# EAGLE schematic soundcard v2.1 (EAGLE 9.6.2)

## Sheet 1 of 8
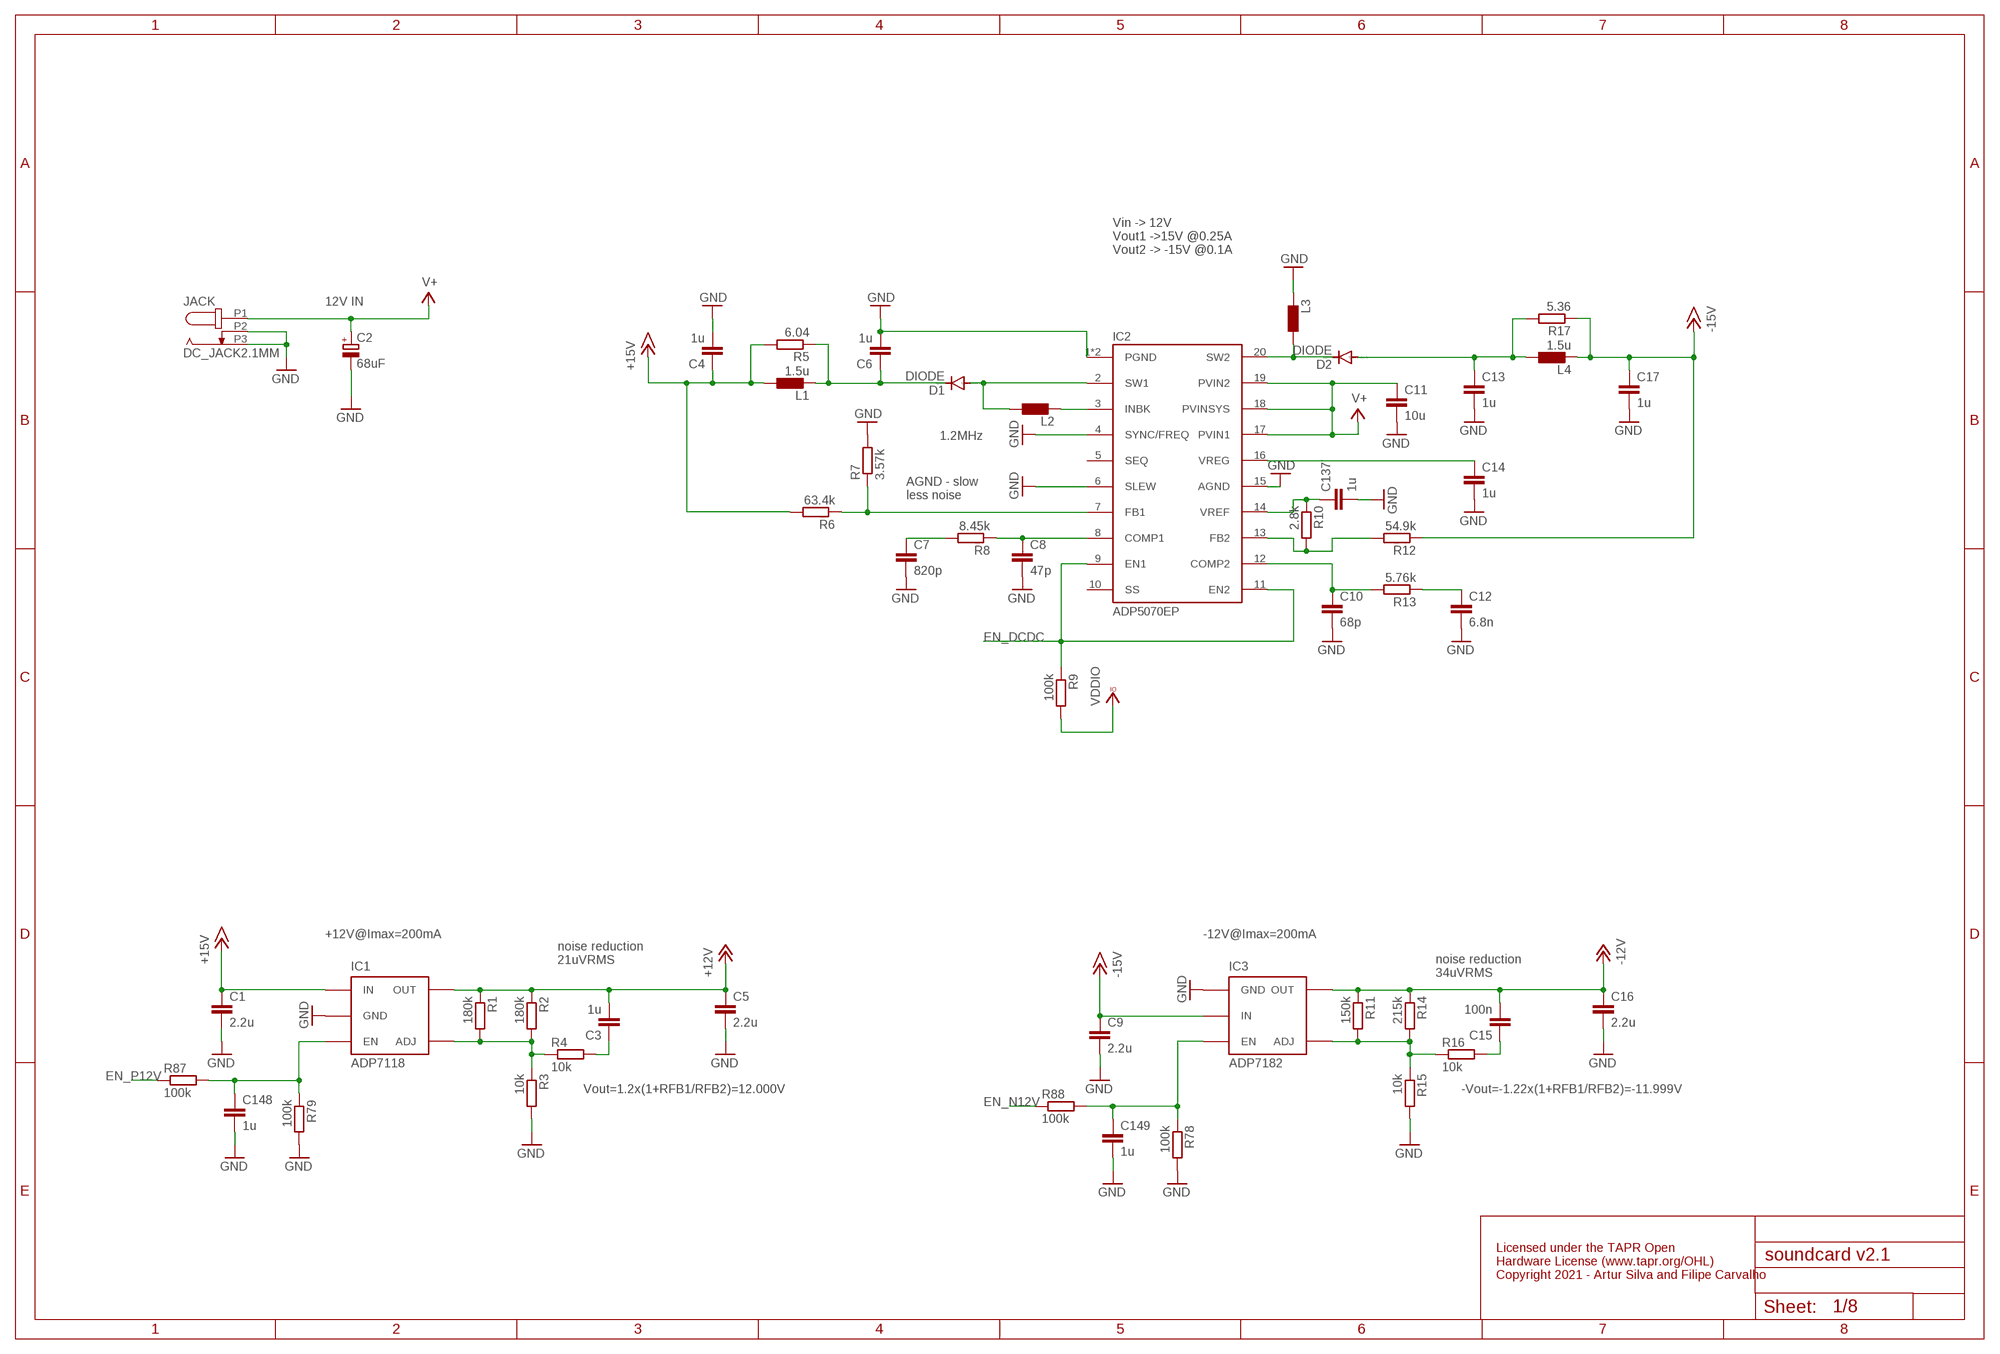
[diagram p0: schematic, sheet 1]

### Parts
C1  2.2u  C-EUC0603  [C0603]
C2  68uF  CPOL-EUE2-5  [E2-5]
C3  1u  C-EUC0402  [C0402]
C4  1u  C-EUC0603  [C0603]
C5  2.2u  C-EUC0603  [C0603]
C6  1u  C-EUC0603  [C0603]
C7  820p  C-EUC0402  [C0402]
C8  47p  C-EUC0402  [C0402]
C9  2.2u  C-EUC0603  [C0603]
C10  68p  C-EUC0402  [C0402]
C11  10u  C-EUC1206  [C1206]
C12  6.8n  C-EUC0402  [C0402]
C13  1u  C-EUC0603  [C0603]
C14  1u  C-EUC0402  [C0402]
C15  100n  C-EUC0402  [C0402]
C16  2.2u  C-EUC0603  [C0603]
C17  1u  C-EUC0603  [C0603]
C137  1u  C-EUC0402  [C0402]
C148  1u  C-EUC0603  [C0603]
C149  1u  C-EUC0603  [C0603]
D1  DIODE  [SOD-323-DIODE]
D2  DIODE  [SOD-323-DIODE]
IC1  ADP7118  [TSOT23-5]
IC2  ADP5070EP  [TSSOP-EP-20]
IC3  ADP7182  [TSOT23-5]
JACK  DC_JACK2.1MM  [DC_POWER_INPUT_2.1MM]
L1  1.5u  INDLPS4012_L  [IND_LPS4012_V2]
L2  INDLPS6225_L  [IND_LPS6225_V2]
L3  INDLPS6225_L  [IND_LPS6225_V2]
L4  1.5u  INDLPS4012_L  [IND_LPS4012_V2]
R1  180k  R-EU_R0402  [R0402]
R2  180k  R-EU_R0402  [R0402]
R3  10k  R-EU_R0402  [R0402]
R4  10k  R-EU_R0402  [R0402]
R5  6.04  R-EU_R0402  [R0402]
R6  63.4k  R-EU_R0402  [R0402]
R7  3.57k  R-EU_R0402  [R0402]
R8  8.45k  R-EU_R0402  [R0402]
R9  100k  R-EU_R0402  [R0402]
R10  2.8k  R-EU_R0402  [R0402]
R11  150k  R-EU_R0402  [R0402]
R12  54.9k  R-EU_R0402  [R0402]
R13  5.76k  R-EU_R0402  [R0402]
R14  215k  R-EU_R0402  [R0402]
R15  10k  R-EU_R0402  [R0402]
R16  10k  R-EU_R0402  [R0402]
R17  5.36  R-EU_R0402  [R0402]
R78  100k  R-EU_R0402  [R0402]
R79  100k  R-EU_R0402  [R0402]
R87  100k  R-EU_R0402  [R0402]
R88  100k  R-EU_R0402  [R0402]

### Nets
+12V: C3.2 C5.1 IC1.5(OUT) R1.1 R2.1 ; also sheet 3,4
+15V: C1.1 C4.1 IC1.1(IN) L1.1 R5.2 R6.2
-12V: C15.2 C16.1 IC3.5(OUT) R11.1 R14.1 ; also sheet 3,4
-15V: C9.1 C17.1 IC3.2(IN) L4.2 R12.1 R17.1
EN_DCDC: IC2.9(EN1) IC2.11(EN2) R9.1 ; also sheet 7
EN_N12V: R88.1 ; also sheet 5
EN_P12V: R87.1 ; also sheet 5
GND: C1.2 C2.- C4.2 C5.2 C6.2 C7.2 C8.2 C9.2 C10.2 C11.2 C12.2 C13.2 C14.2 C16.2 C17.2 C137.2 C148.2 C149.2 IC1.2(GND) IC2.1(PGND) IC2.4(SYNC/FREQ) IC2.6(SLEW) IC2.15(AGND) IC2.EPAD(PGND) IC3.1(GND) JACK.P2 JACK.P3 L3.2 R3.2 R7.2 R15.2 R78.2 R79.2 ; also sheet 2,3,4,5,6,7,8
INBK: IC2.3(INBK) L2.2
N$4: IC2.7(FB1) R6.1 R7.1
N$7: C7.1 R8.2
N$9: C8.1 IC2.8(COMP1) R8.1
N$11: C10.1 IC2.12(COMP2) R13.2
N$12: C12.1 R13.1
N$13: C14.1 IC2.16(VREG)
N$14: C3.1 R4.2
N$18: IC2.13(FB2) R10.2 R12.2
N$22: C137.1 IC2.14(VREF) R10.1
N$26: IC1.4(ADJ) R1.2 R2.2 R3.1 R4.1
N$28: IC3.4(ADJ) R11.2 R14.2 R15.1 R16.1
N$29: C15.1 R16.2
N$79: C148.1 IC1.3(EN) R79.1 R87.2
N$83: C149.1 IC3.3(EN) R78.1 R88.2
OUT_SW1: D1.A IC2.2(SW1) L2.1
OUT_SW2: D2.C IC2.20(SW2) L3.1
OUTN15: C13.1 D2.A L4.1 R17.2
OUTP15: C6.1 D1.C L1.2 R5.1
V+: C2.+ C11.1 IC2.17(PVIN1) IC2.18(PVINSYS) IC2.19(PVIN2) JACK.P1 ; also sheet 2,5
VCCIO: R9.2 ; supply symbol labelled VDDIO ; also sheet 6,7,8
Unconnected: IC2.5(SEQ) IC2.10(SS)

### Notes on the sheet
- Vin -> 12V
  Vout1 ->15V @0.25A
  Vout2 -> -15V @0.1A
- 12V IN
- 1.2MHz
- AGND - slow
  less noise
- +12V@Imax=200mA | -12V@Imax=200mA
- noise reduction 
  21uVRMS
- noise reduction 
  34uVRMS
- Vout=1.2x(1+RFB1/RFB2)=12.000V | -Vout=-1.22x(1+RFB1/RFB2)=-11.999V
- Licensed under the TAPR Open 
  Hardware License (www.tapr.org/OHL)
  Copyright 2021 - Artur Silva and Filipe Carvalho

## Sheet 2 of 8
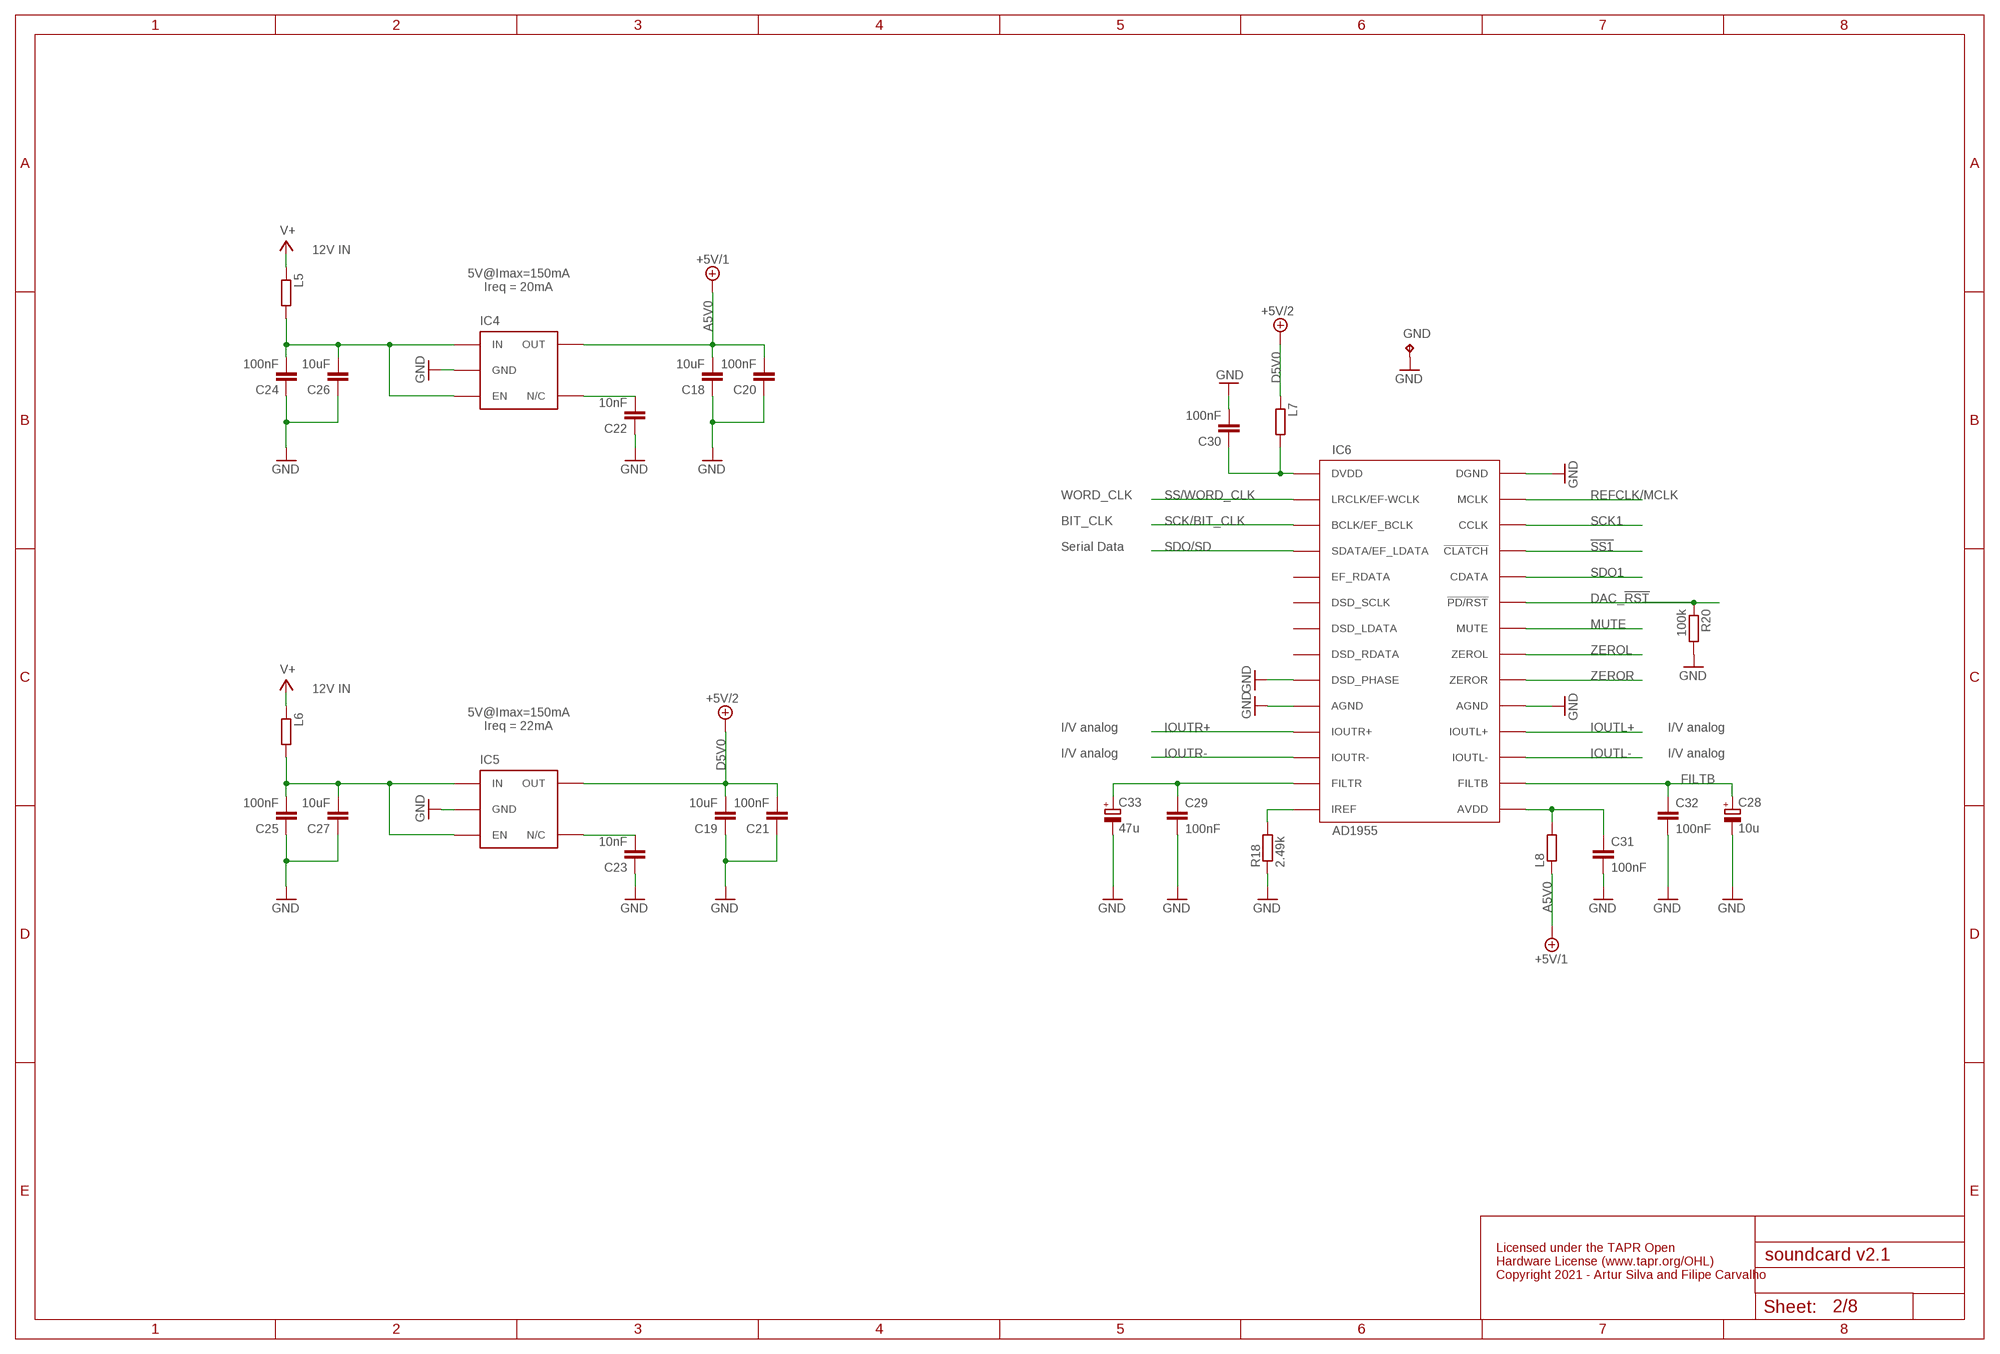
[diagram p1: schematic, sheet 2]

### Parts
C18  10uF  C-EUC0603  [C0603]
C19  10uF  C-EUC0603  [C0603]
C20  100nF  C-EUC0402  [C0402]
C21  100nF  C-EUC0402  [C0402]
C22  10nF  C-EUC0402  [C0402]
C23  10nF  C-EUC0402  [C0402]
C24  100nF  C-EUC0402  [C0402]
C25  100nF  C-EUC0402  [C0402]
C26  10uF  C-EUC0603  [C0603]
C27  10uF  C-EUC0603  [C0603]
C28  10u  CPOL-EUB/3528-21W  [B/3528-21W]
C29  100nF  C-EUC0402  [C0402]
C30  100nF  C-EUC0402  [C0402]
C31  100nF  C-EUC0402  [C0402]
C32  100nF  C-EUC0402  [C0402]
C33  47u  CPOL-EUC/6032-28W  [C/6032-28W]
GND  TP  [TP_1]
IC4  LP5907MFX-3.3  TLV700XX  [TSOT23-5]
IC5  LP5907MFX-3.3  TLV700XX  [TSOT23-5]
IC6  AD1955  [SSOP28]
L5  600@100M  R-EU_R0805  [R0805]
L6  600@100M  R-EU_R0805  [R0805]
L7  600@100M  R-EU_R0805  [R0805]
L8  600@100M  R-EU_R0805  [R0805]
R18  2.49k  R-EU_R0402  [R0402]
R20  100k  R-EU_R0402  [R0402]

### Nets
!SS1: IC6.P25(!CLATCH) ; also sheet 5
A5V0: C18.2 C20.2 IC4.5(OUT) L8.1 ; supply symbol labelled +5V/1 ; also sheet 3
D5V0: C19.2 C21.2 IC5.5(OUT) L7.1 ; supply symbol labelled +5V/2
DAC_!RST: IC6.P23(!PD/RST) R20.1 ; also sheet 5
FILTB: C28.+ C32.1 IC6.P16(FILTB)
GND: C18.1 C19.1 C20.1 C21.1 C22.1 C23.1 C24.1 C25.1 C26.1 C27.1 C28.- C29.2 C30.2 C31.2 C32.2 C33.- GND.TP IC4.2(GND) IC5.2(GND) IC6.P9(DSD_PHASE) IC6.P10(AGND) IC6.P19(AGND) IC6.P28(DGND) R18.1 R20.2 ; also sheet 1,3,4,5,6,7,8
IOUTL+: IC6.P18(IOUTL+) ; also sheet 4
IOUTL-: IC6.P17(IOUTL-) ; also sheet 4
IOUTR+: IC6.P11(IOUTR+) ; also sheet 3
IOUTR-: IC6.P12(IOUTR-) ; also sheet 3
MUTE: IC6.P22(MUTE) ; also sheet 5
N$2: C22.2 IC4.4(N/C)
N$6: C25.2 C27.2 IC5.1(IN) IC5.3(EN) L6.2
N$19: C23.2 IC5.4(N/C)
N$27: C30.1 IC6.P1(DVDD) L7.2
N$31: C29.1 C33.+ IC6.P13(FILTR)
N$32: C31.1 IC6.P15(AVDD) L8.2
N$35: IC6.P14(IREF) R18.2
N$43: C24.2 C26.2 IC4.1(IN) IC4.3(EN) L5.2
REFCLK/MCLK: IC6.P27(MCLK) ; also sheet 5
SCK1: IC6.P26(CCLK) ; also sheet 5
SCK/BIT_CLK: IC6.P3(BCLK/EF_BCLK) ; also sheet 5
SDO1: IC6.P24(CDATA) ; also sheet 5
SDO/SD: IC6.P4(SDATA/EF_LDATA) ; also sheet 5
SS/WORD_CLK: IC6.P2(LRCLK/EF-WCLK) ; also sheet 5
V+: L5.1 L6.1 ; also sheet 1,5
ZEROL: IC6.P21(ZEROL) ; also sheet 5
ZEROR: IC6.P20(ZEROR) ; also sheet 5
Unconnected: IC6.P5(EF_RDATA) IC6.P6(DSD_SCLK) IC6.P7(DSD_LDATA) IC6.P8(DSD_RDATA)

### Notes on the sheet
- 12V IN
- 5V@Imax=150mA
  Ireq = 20mA
- WORD_CLK
- BIT_CLK
- Serial Data
- 12V IN
- 5V@Imax=150mA
  Ireq = 22mA
- I/V analog | I/V analog
- I/V analog | I/V analog
- Licensed under the TAPR Open 
  Hardware License (www.tapr.org/OHL)
  Copyright 2021 - Artur Silva and Filipe Carvalho

## Sheet 3 of 8
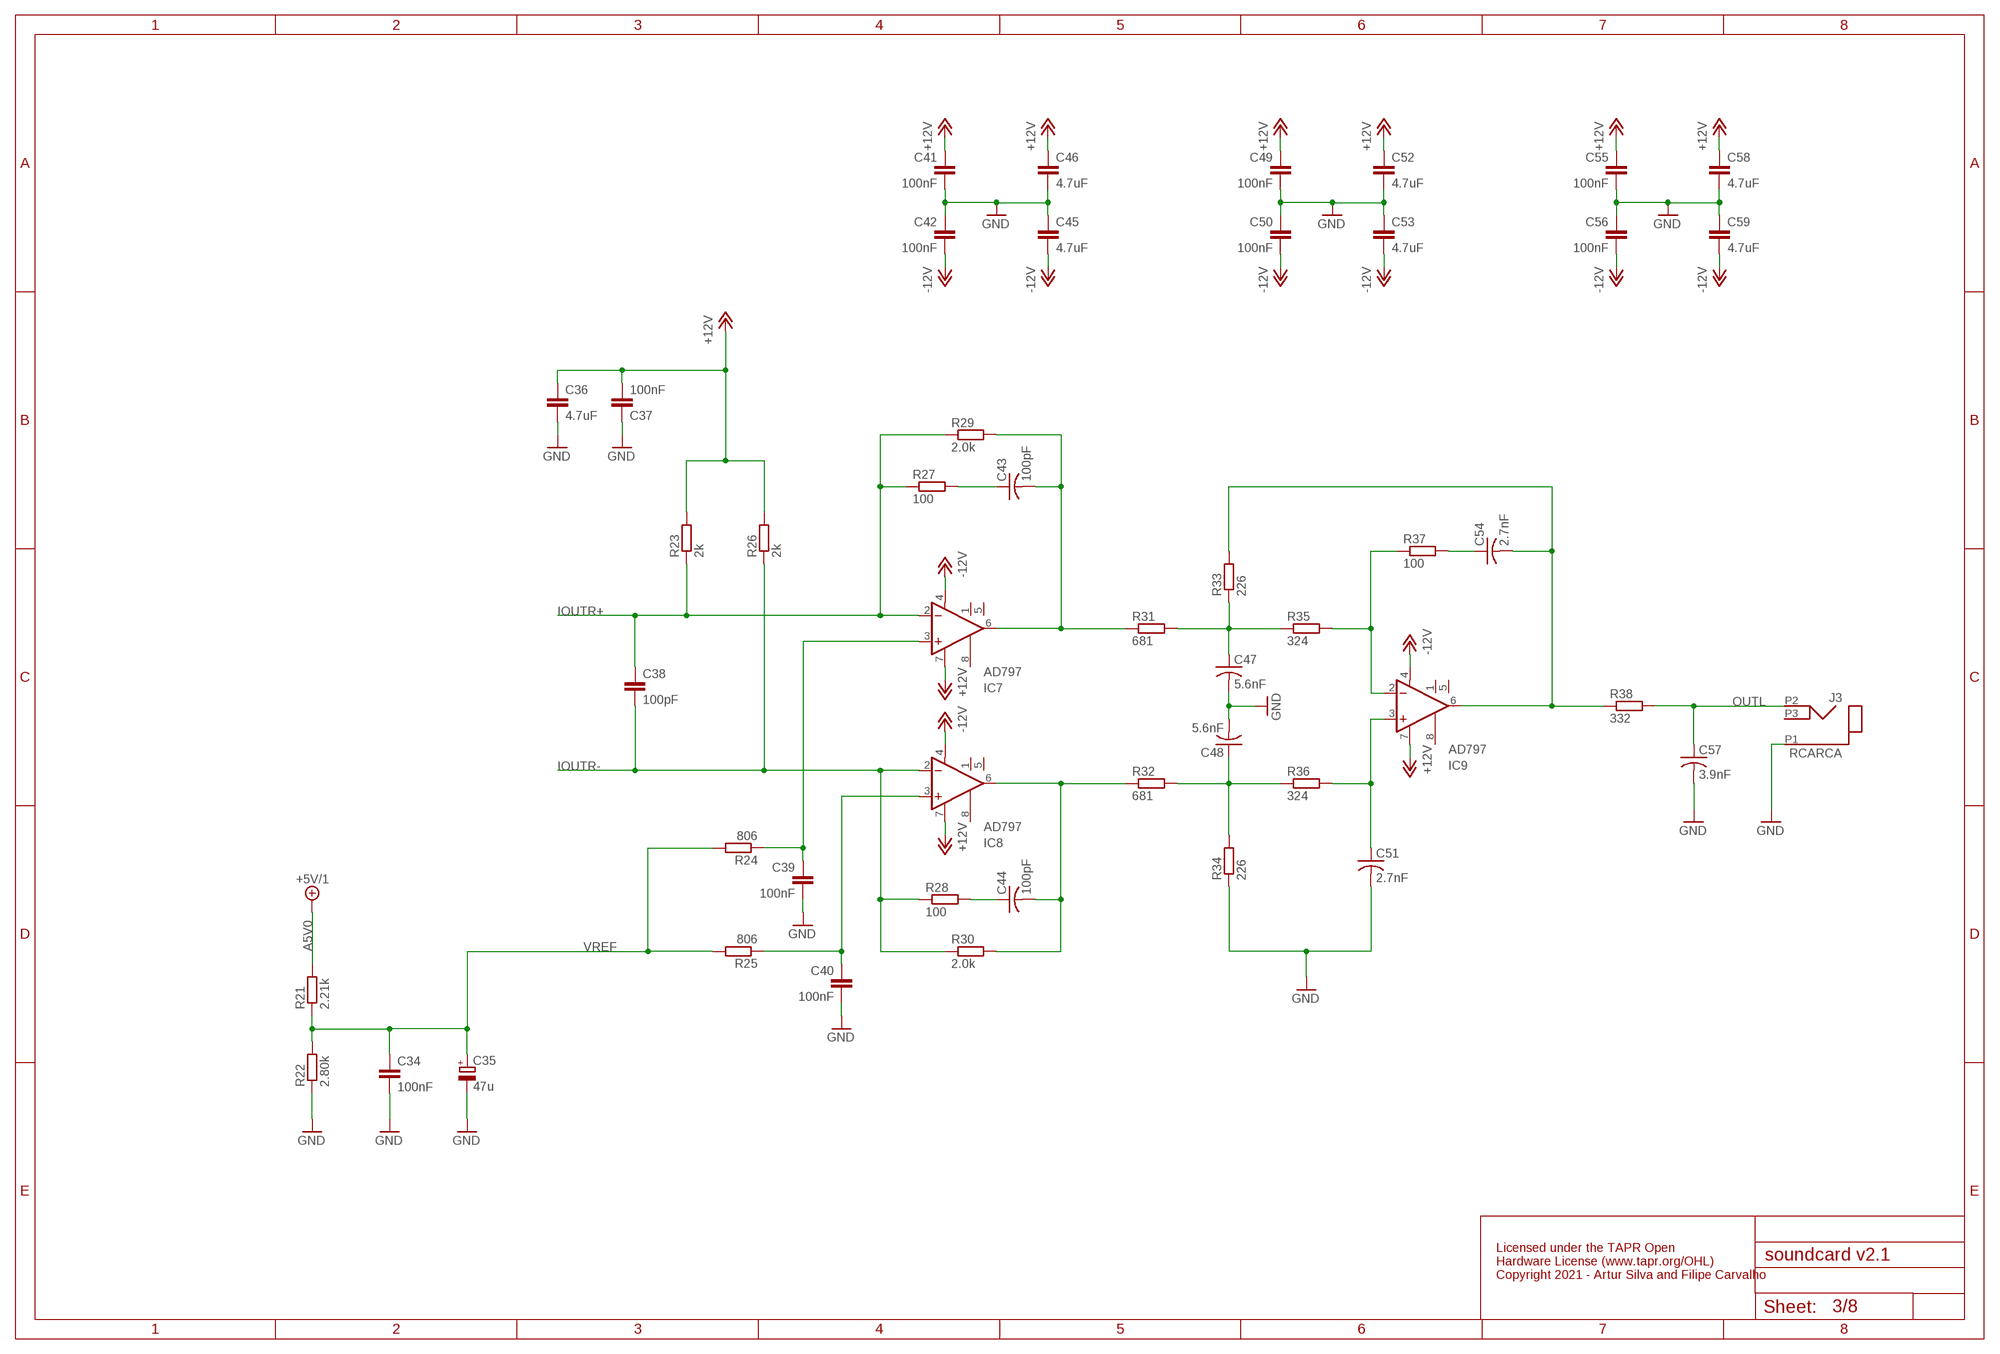
[diagram p2: schematic, sheet 3]

### Parts
C34  100nF  C-EUC0402  [C0402]
C35  47u  CPOL-EUC/6032-28W  [C/6032-28W]
C36  4.7uF  C-EUC0603  [C0603]
C37  100nF  C-EUC0402  [C0402]
C38  100pF  C-EUC0603  [C0603]
C39  100nF  C-EUC0402  [C0402]
C40  100nF  C-EUC0402  [C0402]
C41  100nF  C-EUC0402  [C0402]
C42  100nF  C-EUC0402  [C0402]
C43  100pF  C-US050-025X075  [C050-025X075]
C44  100pF  C-US050-025X075  [C050-025X075]
C45  4.7uF  C-EUC0603  [C0603]
C46  4.7uF  C-EUC0603  [C0603]
C47  5.6nF  C-US050-025X075  [C050-025X075]
C48  5.6nF  C-US050-025X075  [C050-025X075]
C49  100nF  C-EUC0402  [C0402]
C50  100nF  C-EUC0402  [C0402]
C51  2.7nF  C-US050-025X075  [C050-025X075]
C52  4.7uF  C-EUC0603  [C0603]
C53  4.7uF  C-EUC0603  [C0603]
C54  2.7nF  C-US050-025X075  [C050-025X075]
C55  100nF  C-EUC0402  [C0402]
C56  100nF  C-EUC0402  [C0402]
C57  3.9nF  C-US050-025X075  [C050-025X075]
C58  4.7uF  C-EUC0603  [C0603]
C59  4.7uF  C-EUC0603  [C0603]
IC7  AD797  [SO08]
IC8  AD797  [SO08]
IC9  AD797  [SO08]
J3  RCARCA  [RCA]
R21  2.21k  R-EU_R0402  [R0402]
R22  2.80k  R-EU_R0402  [R0402]
R23  2k  R-EU_R0402  [R0402]
R24  806  R-EU_R0402  [R0402]
R25  806  R-EU_R0402  [R0402]
R26  2k  R-EU_R0402  [R0402]
R27  100  R-EU_R0402  [R0402]
R28  100  R-EU_R0402  [R0402]
R29  2.0k  R-EU_R0402  [R0402]
R30  2.0k  R-EU_R0402  [R0402]
R31  681  R-EU_R0402  [R0402]
R32  681  R-EU_R0402  [R0402]
R33  226  R-EU_R0402  [R0402]
R34  226  R-EU_R0402  [R0402]
R35  324  R-EU_R0402  [R0402]
R36  324  R-EU_R0402  [R0402]
R37  100  R-EU_R0402  [R0402]
R38  332  R-EU_R0402  [R0402]

### Nets
+12V: C36.1 C37.2 C41.1 C46.1 C49.1 C52.1 C55.1 C58.1 IC7.7(V+) IC8.7(V+) IC9.7(V+) R23.2 R26.2 ; also sheet 1,4
-12V: C42.2 C45.2 C50.2 C53.2 C56.2 C59.2 IC7.4(V-) IC8.4(V-) IC9.4(V-) ; also sheet 1,4
A5V0: R21.2 ; supply symbol labelled +5V/1 ; also sheet 2
GND: C34.2 C35.- C36.2 C37.1 C39.2 C40.2 C41.2 C42.1 C45.1 C46.2 C47.2 C48.2 C49.2 C50.1 C51.2 C52.2 C53.1 C55.2 C56.1 C57.2 C58.2 C59.1 J3.P1 R22.1 R34.1 ; also sheet 1,2,4,5,6,7,8
IOUTR+: C38.1 IC7.2(-IN) R23.1 R27.1 R29.1 ; also sheet 2
IOUTR-: C38.2 IC8.2(-IN) R26.1 R28.1 R30.1 ; also sheet 2
N$30: C39.1 IC7.3(+IN) R24.1
N$34: C40.1 IC8.3(+IN) R25.1
N$42: C54.1 R37.2
N$45: C44.2 IC8.6(OUT) R30.2 R32.1
N$46: C43.2 IC7.6(OUT) R29.2 R31.1
N$52: C47.1 R31.2 R33.1 R35.1
N$53: C48.1 R32.2 R34.2 R36.1
N$54: IC9.2(-IN) R35.2 R37.1
N$55: C51.1 IC9.3(+IN) R36.2
N$56: C54.2 IC9.6(OUT) R33.2 R38.1
N$58: C43.1 R27.2
N$60: C44.1 R28.2
OUTL: C57.1 J3.P2 R38.2
VREF: C34.1 C35.+ R21.1 R22.2 R24.2 R25.2 ; also sheet 4
Unconnected: IC7.1(NL+) IC7.5(NL-) IC7.8(COMP) IC8.1(NL+) IC8.5(NL-) IC8.8(COMP) IC9.1(NL+) IC9.5(NL-) IC9.8(COMP) J3.P3

### Notes on the sheet
- Licensed under the TAPR Open 
  Hardware License (www.tapr.org/OHL)
  Copyright 2021 - Artur Silva and Filipe Carvalho

## Sheet 4 of 8
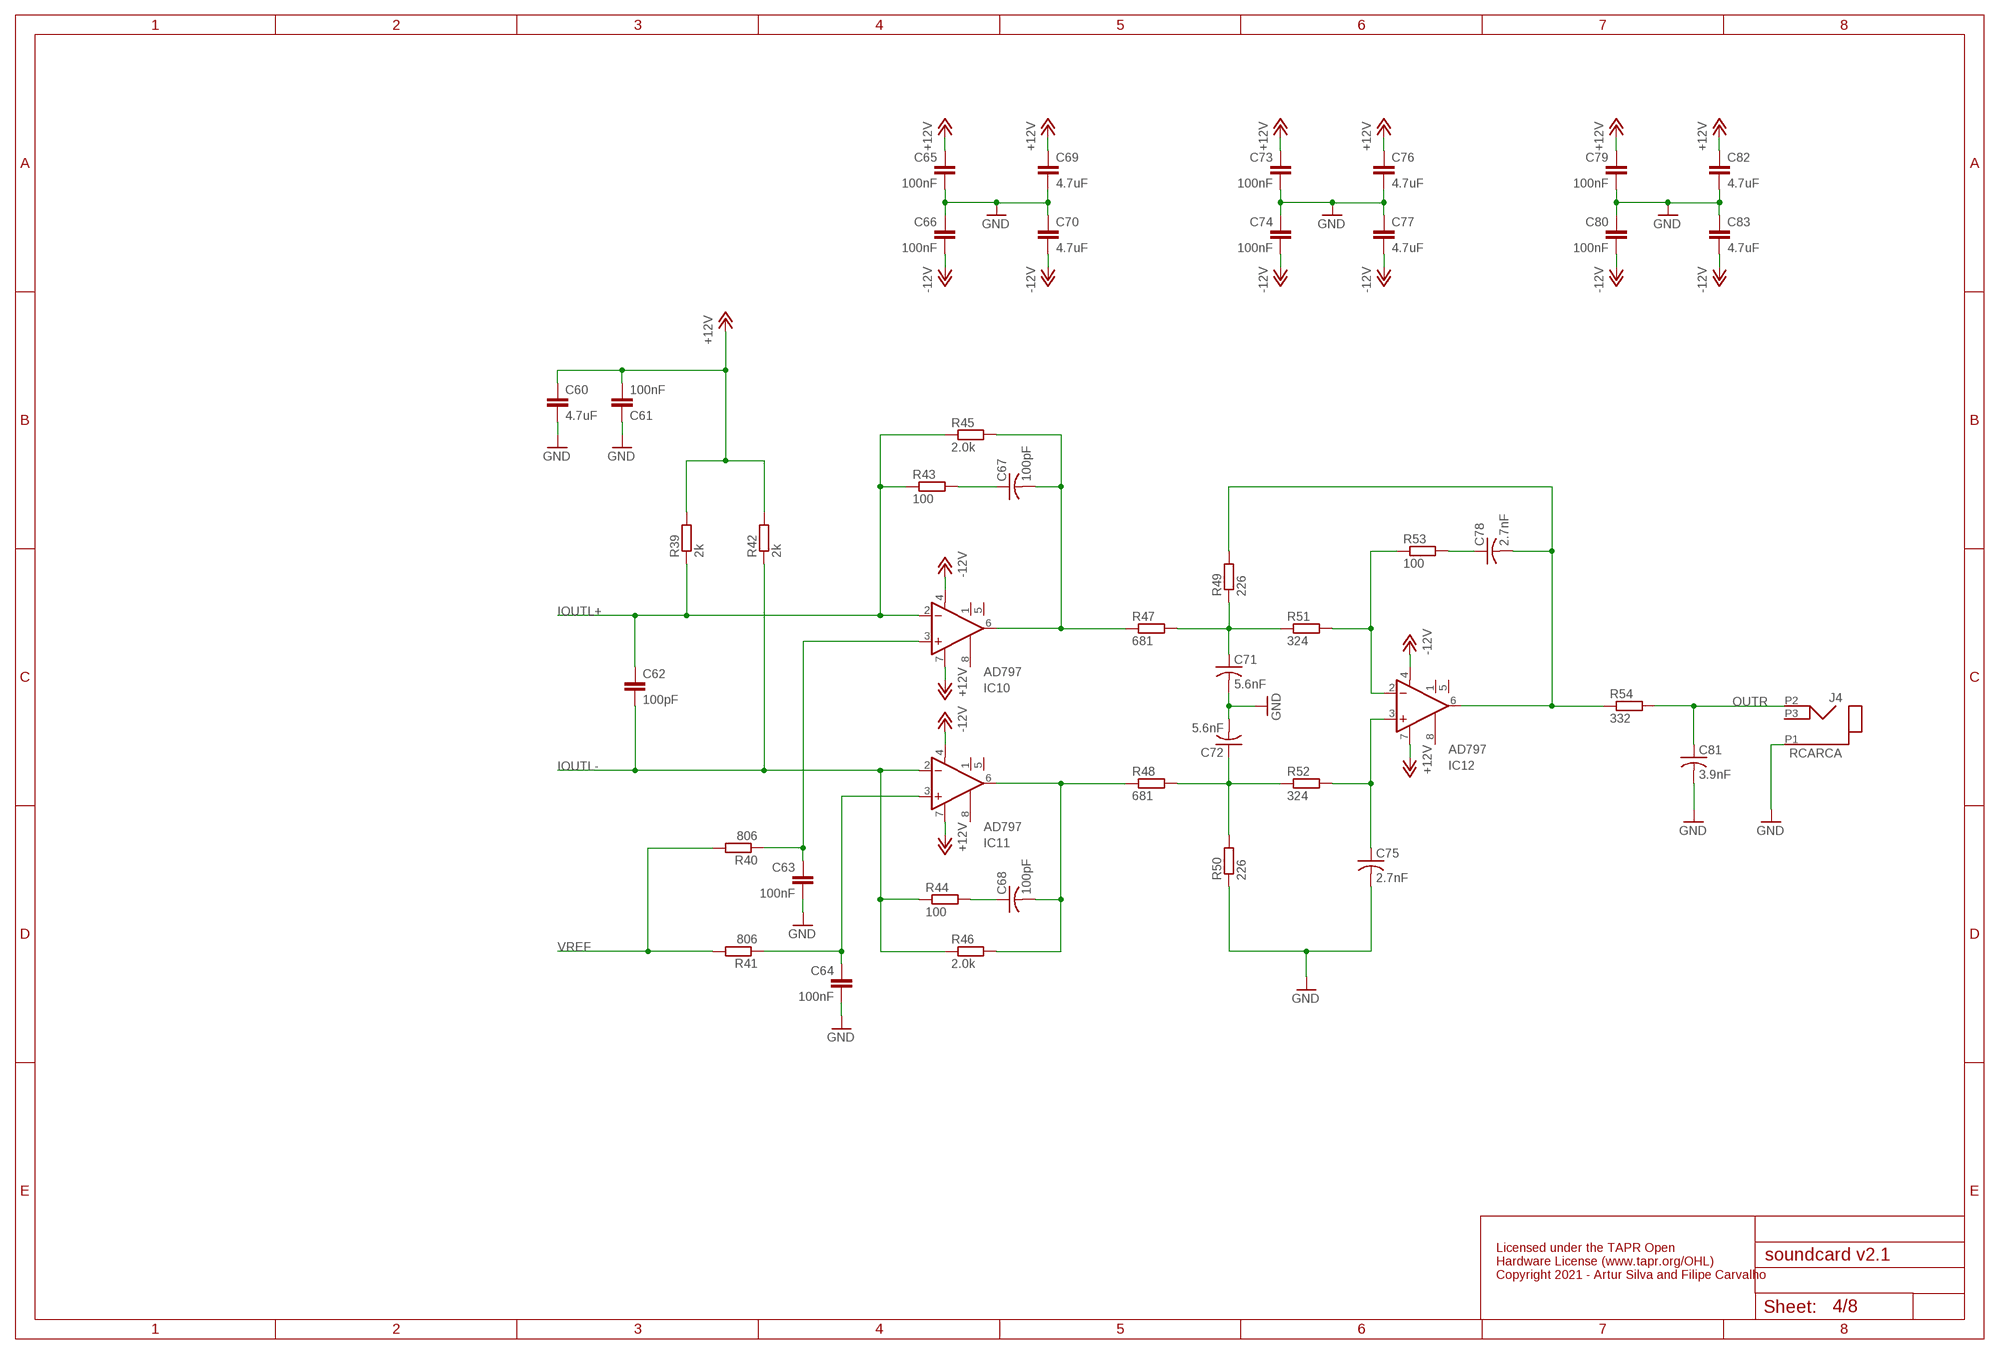
[diagram p3: schematic, sheet 4]

### Parts
C60  4.7uF  C-EUC0603  [C0603]
C61  100nF  C-EUC0402  [C0402]
C62  100pF  C-EUC0603  [C0603]
C63  100nF  C-EUC0402  [C0402]
C64  100nF  C-EUC0402  [C0402]
C65  100nF  C-EUC0402  [C0402]
C66  100nF  C-EUC0402  [C0402]
C67  100pF  C-US050-025X075  [C050-025X075]
C68  100pF  C-US050-025X075  [C050-025X075]
C69  4.7uF  C-EUC0603  [C0603]
C70  4.7uF  C-EUC0603  [C0603]
C71  5.6nF  C-US050-025X075  [C050-025X075]
C72  5.6nF  C-US050-025X075  [C050-025X075]
C73  100nF  C-EUC0402  [C0402]
C74  100nF  C-EUC0402  [C0402]
C75  2.7nF  C-US050-025X075  [C050-025X075]
C76  4.7uF  C-EUC0603  [C0603]
C77  4.7uF  C-EUC0603  [C0603]
C78  2.7nF  C-US050-025X075  [C050-025X075]
C79  100nF  C-EUC0402  [C0402]
C80  100nF  C-EUC0402  [C0402]
C81  3.9nF  C-US050-025X075  [C050-025X075]
C82  4.7uF  C-EUC0603  [C0603]
C83  4.7uF  C-EUC0603  [C0603]
IC10  AD797  [SO08]
IC11  AD797  [SO08]
IC12  AD797  [SO08]
J4  RCARCA  [RCA]
R39  2k  R-EU_R0402  [R0402]
R40  806  R-EU_R0402  [R0402]
R41  806  R-EU_R0402  [R0402]
R42  2k  R-EU_R0402  [R0402]
R43  100  R-EU_R0402  [R0402]
R44  100  R-EU_R0402  [R0402]
R45  2.0k  R-EU_R0402  [R0402]
R46  2.0k  R-EU_R0402  [R0402]
R47  681  R-EU_R0402  [R0402]
R48  681  R-EU_R0402  [R0402]
R49  226  R-EU_R0402  [R0402]
R50  226  R-EU_R0402  [R0402]
R51  324  R-EU_R0402  [R0402]
R52  324  R-EU_R0402  [R0402]
R53  100  R-EU_R0402  [R0402]
R54  332  R-EU_R0402  [R0402]

### Nets
+12V: C60.1 C61.2 C65.1 C69.1 C73.1 C76.1 C79.1 C82.1 IC10.7(V+) IC11.7(V+) IC12.7(V+) R39.2 R42.2 ; also sheet 1,3
-12V: C66.2 C70.2 C74.2 C77.2 C80.2 C83.2 IC10.4(V-) IC11.4(V-) IC12.4(V-) ; also sheet 1,3
GND: C60.2 C61.1 C63.2 C64.2 C65.2 C66.1 C69.2 C70.1 C71.2 C72.2 C73.2 C74.1 C75.2 C76.2 C77.1 C79.2 C80.1 C81.2 C82.2 C83.1 J4.P1 R50.1 ; also sheet 1,2,3,5,6,7,8
IOUTL+: C62.1 IC10.2(-IN) R39.1 R43.1 R45.1 ; also sheet 2
IOUTL-: C62.2 IC11.2(-IN) R42.1 R44.1 R46.1 ; also sheet 2
N$63: C63.1 IC10.3(+IN) R40.1
N$67: C67.2 IC10.6(OUT) R45.2 R47.1
N$69: C68.2 IC11.6(OUT) R46.2 R48.1
N$70: C71.1 R47.2 R49.1 R51.1
N$71: C72.1 R48.2 R50.2 R52.1
N$72: IC12.2(-IN) R51.2 R53.1
N$73: C75.1 IC12.3(+IN) R52.2
N$74: C78.2 IC12.6(OUT) R49.2 R54.1
N$75: C67.1 R43.2
N$76: C68.1 R44.2
N$80: C64.1 IC11.3(+IN) R41.1
N$81: C78.1 R53.2
OUTR: C81.1 J4.P2 R54.2
VREF: R40.2 R41.2 ; also sheet 3
Unconnected: IC10.1(NL+) IC10.5(NL-) IC10.8(COMP) IC11.1(NL+) IC11.5(NL-) IC11.8(COMP) IC12.1(NL+) IC12.5(NL-) IC12.8(COMP) J4.P3

### Notes on the sheet
- Licensed under the TAPR Open 
  Hardware License (www.tapr.org/OHL)
  Copyright 2021 - Artur Silva and Filipe Carvalho

## Sheet 5 of 8
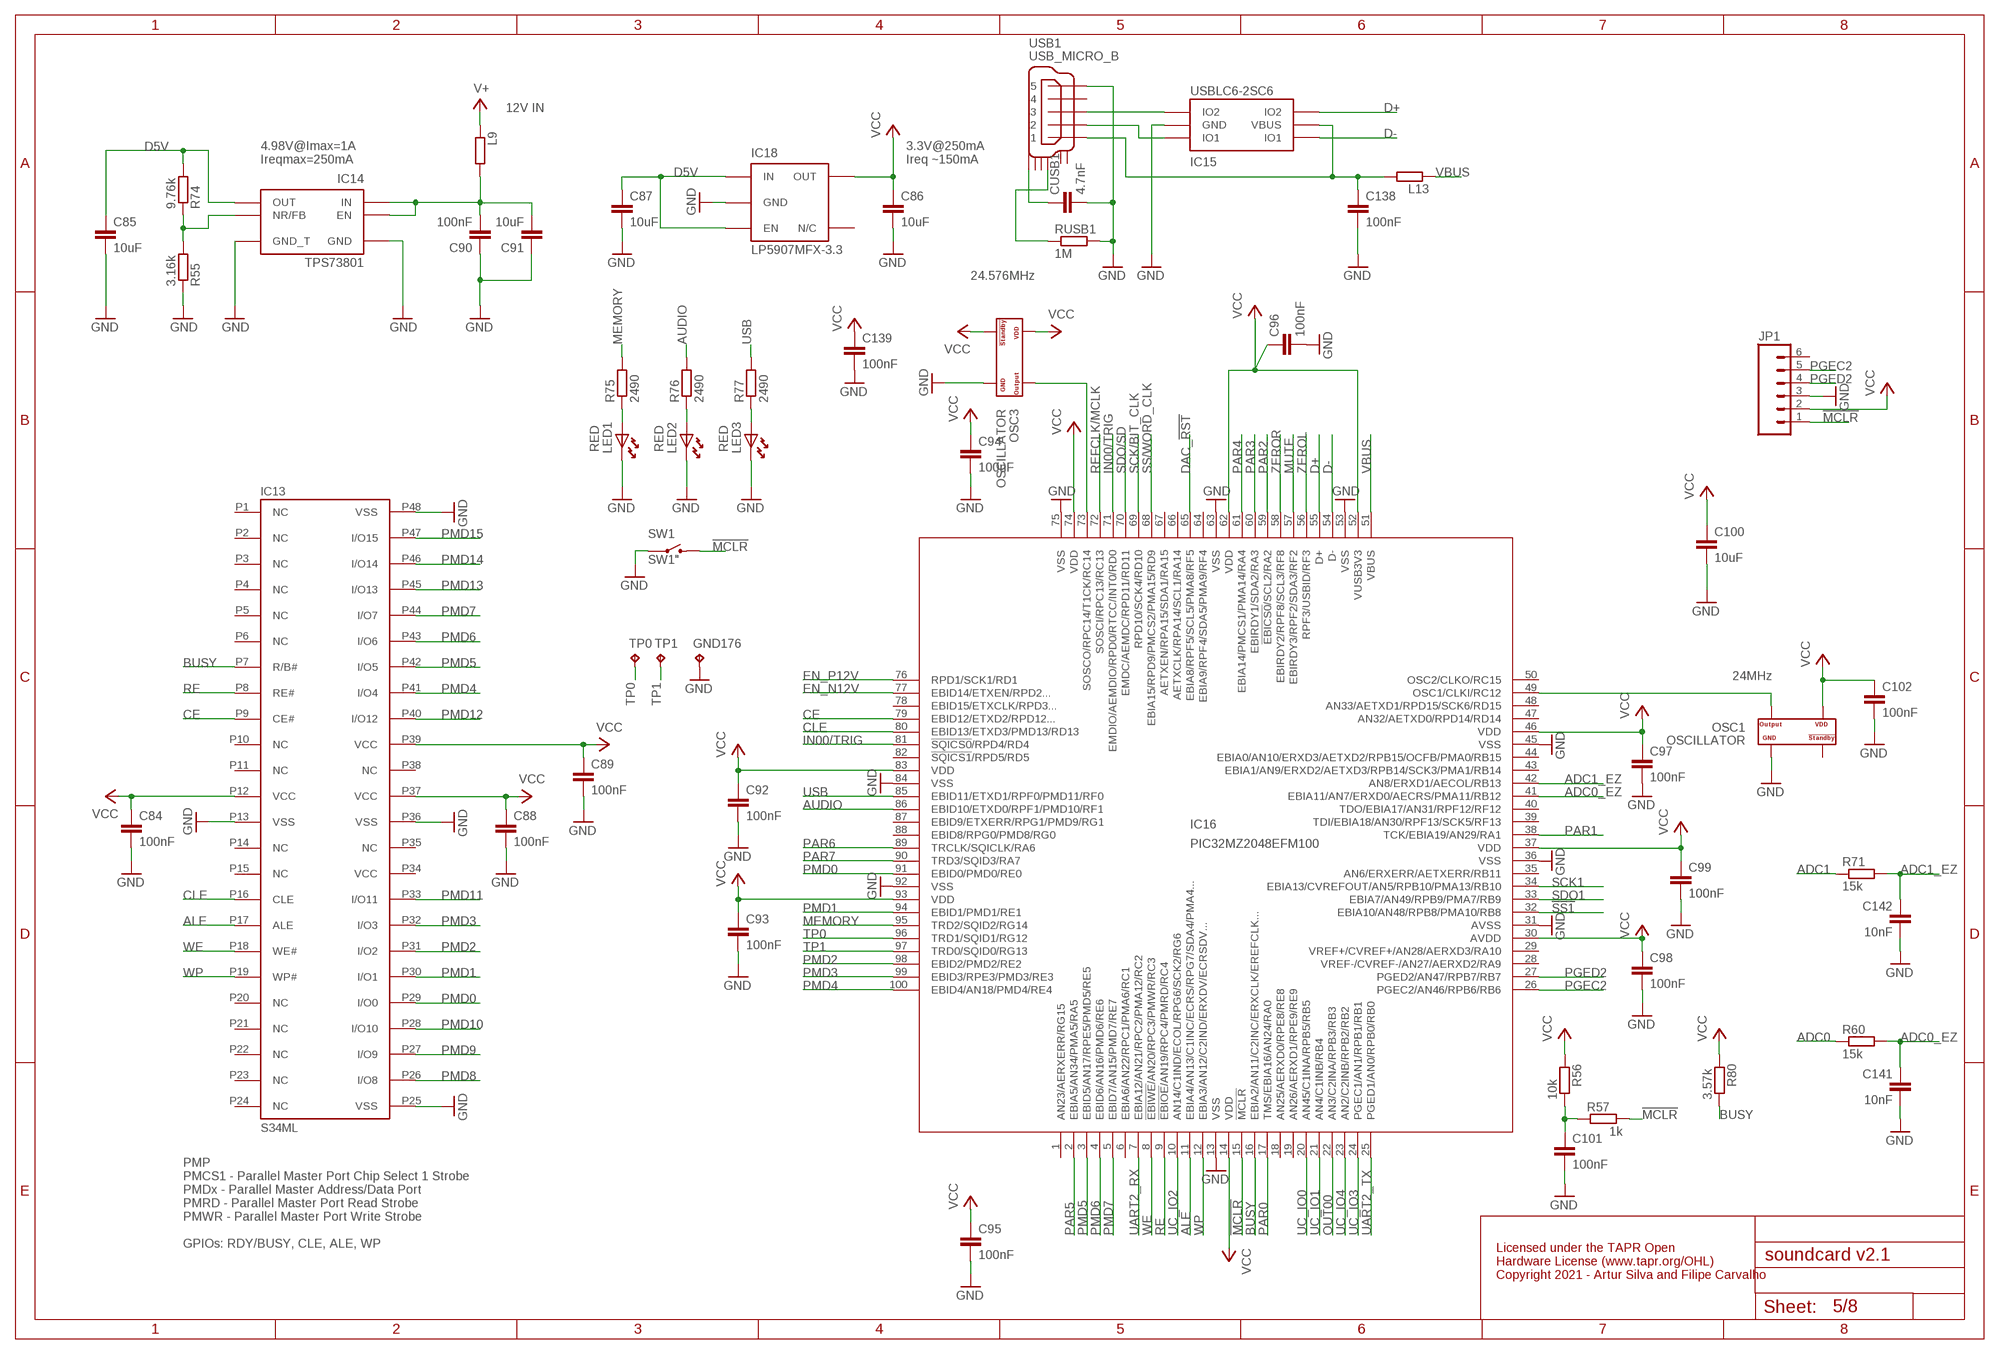
[diagram p4: schematic, sheet 5]

### Parts
C84  100nF  C-EUC0402  [C0402]
C85  10uF  C-EUC0603  [C0603]
C86  10uF  C-EUC0603  [C0603]
C87  10uF  C-EUC0603  [C0603]
C88  100nF  C-EUC0402  [C0402]
C89  100nF  C-EUC0402  [C0402]
C90  100nF  C-EUC0402  [C0402]
C91  10uF  C-EUC0603  [C0603]
C92  100nF  C-EUC0402  [C0402]
C93  100nF  C-EUC0402  [C0402]
C94  100nF  C-EUC0402  [C0402]
C95  100nF  C-EUC0402  [C0402]
C96  100nF  C-EUC0402  [C0402]
C97  100nF  C-EUC0402  [C0402]
C98  100nF  C-EUC0402  [C0402]
C99  100nF  C-EUC0402  [C0402]
C100  10uF  C-EUC0603  [C0603]
C101  100nF  C-EUC0402  [C0402]
C102  100nF  C-EUC0402  [C0402]
C138  100nF  C-EUC0402  [C0402]
C139  100nF  C-EUC0402  [C0402]
C141  10nF  C-EUC0402  [C0402]
C142  10nF  C-EUC0402  [C0402]
CUSB1  4.7nF  C-EUC0402  [C0402]
GND176  TP  [TP_1]
IC13  S34ML  [TSOP-48]
IC14  TPS73801  [SOT223-6]
IC15  USBLC6-2SC6  USBLC6-2  [SOT23-6L]
IC16  PIC32MZ2048EFM100  [TQFP-100]
IC18  LP5907MFX-3.3  TLV700XX  [TSOT23-5]
JP1  M06NO_SILK  [1X06_NO_SILK]
L9  600@100M  R-EU_R0805  [R0805]
L13  ???  R-EU_R0805  [R0805]
LED1  RED  LEDHAND  [LED_HAND]
LED2  RED  LEDHAND  [LED_HAND]
LED3  RED  LEDHAND  [LED_HAND]
OSC1  OSCILLATOR  [OSCILLATOR_3.2X2.5]
OSC3  OSCILLATOR  [OSCILLATOR_3.2X2.5]
R55  3.16k  R-EU_R0402  [R0402]
R56  10k  R-EU_R0402  [R0402]
R57  1k  R-EU_R0402  [R0402]
R60  15k  R-EU_R0402  [R0402]
R71  15k  R-EU_R0402  [R0402]
R74  9.76k  R-EU_R0402  [R0402]
R75  2490  R-EU_R0402  [R0402]
R76  2490  R-EU_R0402  [R0402]
R77  2490  R-EU_R0402  [R0402]
R80  3.57k  R-EU_R0402  [R0402]
RUSB1  1M  R-EU_R0402  [R0402]
SW1  SW1"  [SWITCH_KSS]
TP0  TP  [TP_1]
TP1  TP  [TP_1]
USB1  USB_MICRO_B  [ZX62D-B-5P8]

### Nets
!MCLR: IC16.15(!MCLR) JP1.1 R57.1 SW1.O
!SS1: IC16.32(EBIA10/AN48/RPB8/PMA10/RB8) ; also sheet 2
ADC0: R60.1 ; also sheet 7,8
ADC0_EZ: C141.1 IC16.41(EBIA11/AN7/ERXD0/AECRS/PMA11/RB12) R60.2
ADC1: R71.1 ; also sheet 7,8
ADC1_EZ: C142.1 IC16.42(AN8/ERXD1/AECOL/RB13) R71.2
ALE: IC13.P17(ALE) IC16.11(EBIA4/AN13/C1INC/ECRS/RPG7/SDA4/PMA4...)
AUDIO: IC16.86(EBID10/ETXD0/RPF1/PMD10/RF1) R76.2
BUSY: IC13.P7(R/B#) IC16.16(EBIA2/AN11/C2INC/ERXCLK/EREFCLK...) R80.1
CE: IC13.P9(CE#) IC16.79(EBID12/ETXD2/RPD12...)
CLE: IC13.P16(CLE) IC16.80(EBID13/ETXD3/PMD13/RD13)
D5V: C85.1 C87.1 IC14.P$2(OUT) IC18.1(IN) IC18.3(EN) R74.2 ; also sheet 6,8
D+: IC15.P$4(IO2) IC16.55(D+)
D-: IC15.P$6(IO1) IC16.54(D-)
DAC_!RST: IC16.65(EBIA8/RPF5/SCL5/PMA8/RF5) ; also sheet 2
EN_N12V: IC16.77(EBID14/ETXEN/RPD2...) ; also sheet 1
EN_P12V: IC16.76(RPD1/SCK1/RD1) ; also sheet 1
GND: C84.2 C85.2 C86.2 C87.2 C88.2 C89.2 C90.1 C91.1 C92.2 C93.2 C94.2 C95.2 C96.2 C97.2 C98.2 C99.2 C100.2 C101.2 C102.2 C138.2 C139.2 C141.2 C142.2 CUSB1.2 GND176.TP IC13.P13(VSS) IC13.P25(VSS) IC13.P36(VSS) IC13.P48(VSS) IC14.P$3(GND) IC14.P$6(GND_T) IC15.P$2(GND) IC16.13(VSS) IC16.31(AVSS) IC16.36(VSS) IC16.45(VSS) IC16.53(VSS) IC16.63(VSS) IC16.75(VSS) IC16.84(VSS) IC16.92(VSS) IC18.2(GND) JP1.3 LED1.K LED2.K LED3.K OSC1.P$2(GND) OSC3.P$2(GND) R55.1 RUSB1.2 SW1.P USB1.P$5 ; also sheet 1,2,3,4,6,7,8
IN00/TRIG: IC16.71(EMDIO/AEMDIO/RPD0/RTCC/INT0/RD0) IC16.81(!SQICS0!/RPD4/RD4) ; also sheet 7,8
MEMORY: IC16.95(TRD2/SQID2/RG14) R75.2
MUTE: IC16.57(EBIRDY3/RPF2/SDA3/RF2) ; also sheet 2
N$3: IC14.P$4(NR/FB) R55.2 R74.1
N$5: C90.2 C91.2 IC14.P$1(IN) IC14.P$5(EN) L9.2
N$15: IC16.73(SOSCO/RPC14/T1CK/RC14) OSC3.P$3(OUTPUT)
N$36: LED1.A R75.1
N$51: LED2.A R76.1
N$64: LED3.A R77.1
N$65: IC16.49(OSC1/CLKI/RC12) OSC1.P$3(OUTPUT)
N$66: IC15.P$1(IO1) USB1.P$2
N$68: IC15.P$3(IO2) USB1.P$3
N$77: CUSB1.1 USB1.SHIELD_4
N$78: RUSB1.1 USB1.SHIELD_3
N$82: C101.1 R56.1 R57.2
OUT00: IC16.22(AN3/C2INA/RPB3/RB3) ; also sheet 7,8
PAR0: IC16.17(TMS/EBIA16/AN24/RA0) ; also sheet 7
PAR1: IC16.38(TCK/EBIA19/AN29/RA1) ; also sheet 7
PAR2: IC16.59(!EBICS0!/SCL2/RA2) ; also sheet 7
PAR3: IC16.60(EBIRDY1/SDA2/RA3) ; also sheet 7
PAR4: IC16.61(EBIA14/PMCS1/PMA14/RA4) ; also sheet 7
PAR5: IC16.2(EBIA5/AN34/PMA5/RA5) ; also sheet 7
PAR6: IC16.89(TRCLK/SQICLK/RA6) ; also sheet 7
PAR7: IC16.90(TRD3/SQID3/RA7) ; also sheet 7
PGEC2: IC16.26(PGEC2/AN46/RPB6/RB6) JP1.5
PGED2: IC16.27(PGED2/AN47/RPB7/RB7) JP1.4
PMD0: IC13.P29(I/O0) IC16.91(EBID0/PMD0/RE0)
PMD1: IC13.P30(I/O1) IC16.94(EBID1/PMD1/RE1)
PMD2: IC13.P31(I/O2) IC16.98(EBID2/PMD2/RE2)
PMD3: IC13.P32(I/O3) IC16.99(EBID3/RPE3/PMD3/RE3)
PMD4: IC13.P41(I/O4) IC16.100(EBID4/AN18/PMD4/RE4)
PMD5: IC13.P42(I/O5) IC16.3(EBID5/AN17/RPE5/PMD5/RE5)
PMD6: IC13.P43(I/O6) IC16.4(EBID6/AN16/PMD6/RE6)
PMD7: IC13.P44(I/O7) IC16.5(EBID7/AN15/PMD7/RE7)
PMD8: IC13.P26(I/O8)
PMD9: IC13.P27(I/O9)
PMD10: IC13.P28(I/O10)
PMD11: IC13.P33(I/O11)
PMD12: IC13.P40(I/O12)
PMD13: IC13.P45(I/O13)
PMD14: IC13.P46(I/O14)
PMD15: IC13.P47(I/O15)
RE: IC13.P8(RE#) IC16.9(!EBIOE!/AN19/RPC4/PMRD/RC4)
REFCLK/MCLK: IC16.72(SOSCI/RPC13/RC13) ; also sheet 2
SCK1: IC16.34(EBIA13/CVREFOUT/AN5/RPB10/PMA13/RB10) ; also sheet 2
SCK/BIT_CLK: IC16.69(RPD10/SCK4/RD10) ; also sheet 2
SDO1: IC16.33(EBIA7/AN49/RPB9/PMA7/RB9) ; also sheet 2
SDO/SD: IC16.70(EMDC/AEMDC/RPD11/RD11) ; also sheet 2
SS/WORD_CLK: IC16.68(EBIA15/RPD9/PMCS2/PMA15/RD9) ; also sheet 2
TP0: IC16.96(TRD1/SQID1/RG12) TP0.TP
TP1: IC16.97(TRD0/SQID0/RG13) TP1.TP
UART2_RX: IC16.7(EBIA12/AN21/RPC2/PMA12/RC2) ; also sheet 7
UART2_TX: IC16.25(PGED1/AN0/RPB0/RB0) ; also sheet 7
UC_IO0: IC16.20(AN45/C1INA/RPB5/RB5) ; also sheet 7
UC_IO1: IC16.21(AN4/C1INB/RB4) ; also sheet 7
UC_IO2: IC16.10(AN14/C1IND/ECOL/RPG6/SCK2/RG6) ; also sheet 7
UC_IO3: IC16.24(PGEC1/AN1/RPB1/RB1) ; also sheet 7
UC_IO4: IC16.23(AN2/C2INB/RPB2/RB2) ; also sheet 7
USB: IC16.85(EBID11/ETXD1/RPF0/PMD11/RF0) R77.2
V+: L9.1 ; also sheet 1,2
VBUS: IC16.51(VBUS) L13.1
VBUSX: C138.1 IC15.P$5(VBUS) L13.2 USB1.P$1
VCC: C84.1 C86.1 C88.1 C89.1 C92.1 C93.1 C94.1 C95.1 C96.1 C97.1 C98.1 C99.1 C100.1 C102.1 C139.1 IC13.P12(VCC) IC13.P37(VCC) IC13.P39(VCC) IC16.14(VDD) IC16.30(AVDD) IC16.37(VDD) IC16.46(VDD) IC16.52(VUSB3V3) IC16.62(VDD) IC16.74(VDD) IC16.83(VDD) IC16.93(VDD) IC18.5(OUT) JP1.2 OSC1.P$4(VDD) OSC3.P$1(STANDBY#) OSC3.P$4(VDD) R56.2 R80.2
WE: IC13.P18(WE#) IC16.8(!EBIWE!/AN20/RPC3/PMWR/RC3)
WP: IC13.P19(WP#) IC16.12(EBIA3/AN12/C2IND/ERXDV/ECRSDV...)
ZEROL: IC16.56(RPF3/USBID/RF3) ; also sheet 2
ZEROR: IC16.58(EBIRDY2/RPF8/SCL3/RF8) ; also sheet 2
Unconnected: IC13.P1(NC) IC13.P2(NC) IC13.P3(NC) IC13.P4(NC) IC13.P5(NC) IC13.P6(NC) IC13.P10(NC) IC13.P11(NC) IC13.P14(NC) IC13.P15(NC) IC13.P20(NC) IC13.P21(NC) IC13.P22(NC) IC13.P23(NC) IC13.P24(NC) IC13.P34(VCC) IC13.P35(NC) IC13.P38(NC) IC16.1(AN23/AERXERR/RG15) IC16.6(EBIA6/AN22/RPC1/PMA6/RC1) IC16.18(AN25/AERXD0/RPE8/RE8) IC16.19(AN26/AERXD1/RPE9/RE9) IC16.28(VREF-/CVREF-/AN27/AERXD2/RA9) IC16.29(VREF+/CVREF+/AN28/AERXD3/RA10) IC16.35(AN6/ERXERR/AETXERR/RB11) IC16.39(TDI/EBIA18/AN30/RPF13/SCK5/RF13) IC16.40(TDO/EBIA17/AN31/RPF12/RF12) IC16.43(EBIA1/AN9/ERXD2/AETXD3/RPB14/SCK3/PMA1/RB14) IC16.44(EBIA0/AN10/ERXD3/AETXD2/RPB15/OCFB/PMA0/RB15) IC16.47(AN32/AETXD0/RPD14/RD14) IC16.48(AN33/AETXD1/RPD15/SCK6/RD15) IC16.50(OSC2/CLKO/RC15) IC16.64(EBIA9/RPF4/SDA5/PMA9/RF4) IC16.66(AETXCLK/RPA14/SCL1/RA14) IC16.67(AETXEN/RPA15/SDA1/RA15) IC16.78(EBID15/ETXCLK/RPD3...) IC16.82(!SQICS1!/RPD5/RD5) IC16.87(EBID9/ETXERR/RPG1/PMD9/RG1) IC16.88(EBID8/RPG0/PMD8/RG0) IC18.4(N/C) JP1.6 OSC1.P$1(STANDBY#) USB1.P$4 USB1.P$6 USB1.P$7 USB1.SHIELD_1 USB1.SHIELD_2

### Notes on the sheet
- 12V IN
- 4.98V@Imax=1A
  Ireqmax=250mA
- 3.3V@250mA
  Ireq ~150mA
- 24.576MHz
- 24MHz
- PMP
  PMCS1 - Parallel Master Port Chip Select 1 Strobe
  PMDx - Parallel Master Address/Data Port
  PMRD - Parallel Master Port Read Strobe
  PMWR - Parallel Master Port Write Strobe
  
  GPIOs: RDY/BUSY, CLE, ALE, WP
- Licensed under the TAPR Open 
  Hardware License (www.tapr.org/OHL)
  Copyright 2021 - Artur Silva and Filipe Carvalho

## Sheet 6 of 8
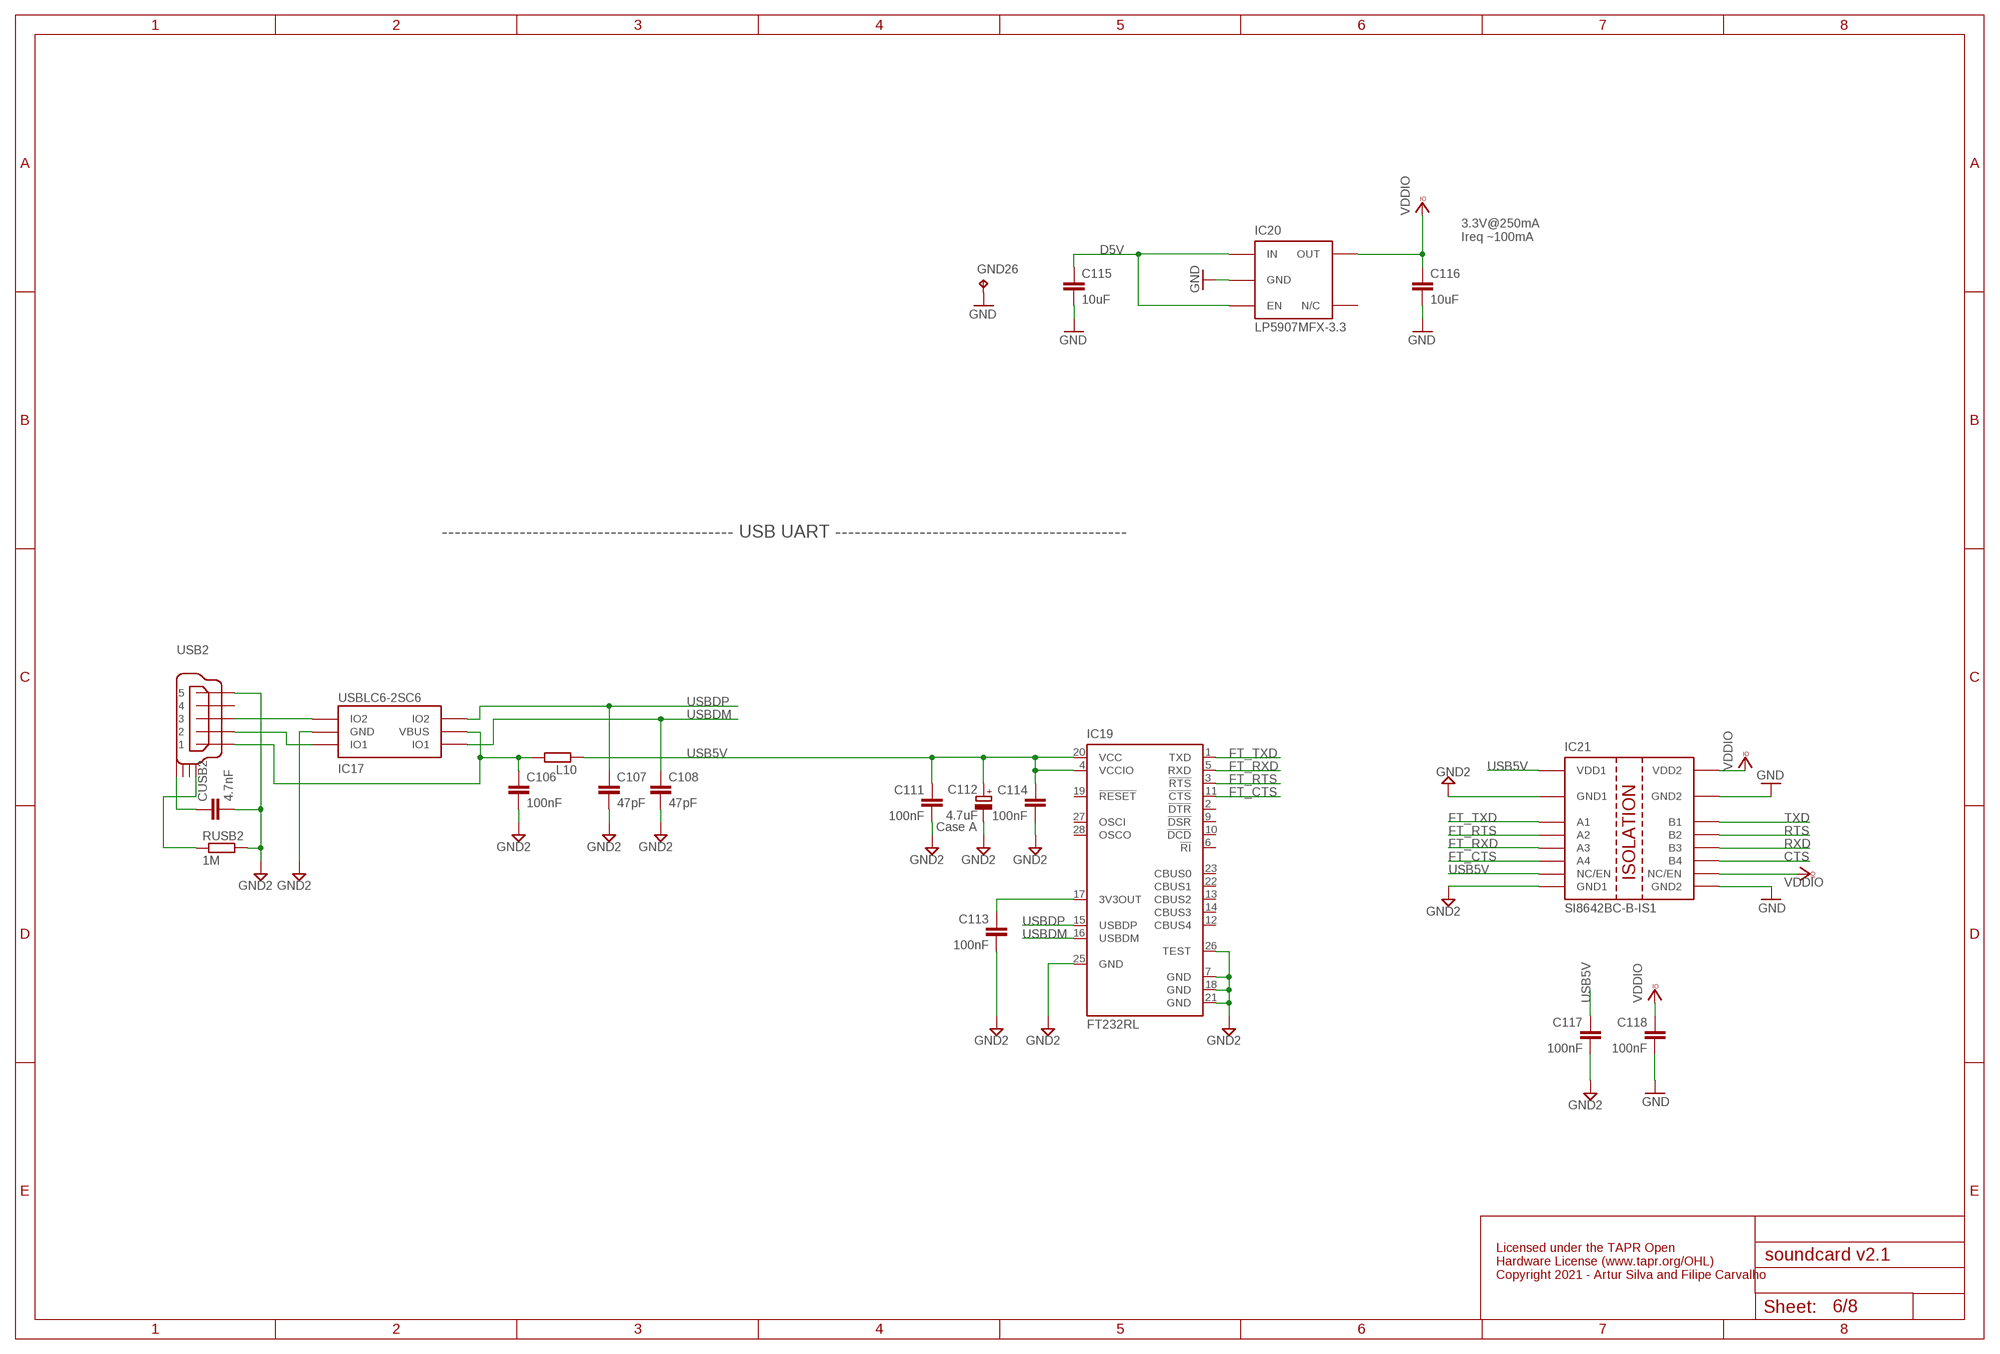
[diagram p5: schematic, sheet 6]

### Parts
C106  100nF  C-EUC0402  [C0402]
C107  47pF  C-EUC0402  [C0402]
C108  47pF  C-EUC0402  [C0402]
C111  100nF  C-EUC0402  [C0402]
C112  4.7uF  CPOL-EUA/3216-18W  [A/3216-18W]
C113  100nF  C-EUC0402  [C0402]
C114  100nF  C-EUC0402  [C0402]
C115  10uF  C-EUC0603  [C0603]
C116  10uF  C-EUC0603  [C0603]
C117  100nF  C-EUC0402  [C0402]
C118  100nF  C-EUC0402  [C0402]
CUSB2  4.7nF  C-EUC0402  [C0402]
GND26  TP  [TP_1]
IC17  USBLC6-2SC6  USBLC6-2  [SOT23-6L]
IC19  FT232RL  [SSOP28]
IC20  LP5907MFX-3.3  TLV700XX  [TSOT23-5]
IC21  SI8642BC-B-IS1  SI8645  [NSOIC-16]
L10  ???  R-EU_R0805  [R0805]
RUSB2  1M  R-EU_R0402  [R0402]
USB2  USB_MINI_B  [240-0002-1]

### Nets
CTS: IC21.11(B4) ; also sheet 7
D5V: C115.1 IC20.1(IN) IC20.3(EN) ; also sheet 5,8
FT_CTS: IC19.11(!CTS) IC21.6(A4)
FT_RTS: IC19.3(!RTS) IC21.4(A2)
FT_RXD: IC19.5(RXD) IC21.5(A3)
FT_TXD: IC19.1(TXD) IC21.3(A1)
GND: C115.2 C116.2 C118.2 GND26.TP IC20.2(GND) IC21.9(GND2) IC21.15(GND2) ; also sheet 1,2,3,4,5,7,8
GND2: C106.2 C107.2 C108.2 C111.2 C112.- C113.2 C114.2 C117.2 CUSB2.2 IC17.P$2(GND) IC19.7(GND) IC19.18(GND) IC19.21(GND) IC19.25(GND) IC19.26(TEST) IC21.2(GND1) IC21.8(GND1) RUSB2.2 USB2.P$5
N$38: C113.1 IC19.17(3V3OUT)
N$39: C106.1 IC17.P$5(VBUS) L10.2 USB2.P$1
N$40: IC17.P$1(IO1) USB2.P$2
N$50: IC17.P$3(IO2) USB2.P$3
N$59: CUSB2.1 USB2.SHIELD_4
N$61: RUSB2.1 USB2.SHIELD_1
RTS: IC21.13(B2) ; also sheet 7
RXD: IC21.12(B3) ; also sheet 7
TXD: IC21.14(B1) ; also sheet 7
USB5V: C111.1 C112.+ C114.1 C117.1 IC19.4(VCCIO) IC19.20(VCC) IC21.1(VDD1) IC21.7(NC/EN) L10.1
USBDM: C108.1 IC17.P$6(IO1) IC19.16(USBDM)
USBDP: C107.1 IC17.P$4(IO2) IC19.15(USBDP)
VCCIO: C116.1 C118.1 IC20.5(OUT) IC21.10(NC/EN) IC21.16(VDD2) ; supply symbol labelled VDDIO ; also sheet 1,7,8
Unconnected: IC19.2(!DTR) IC19.6(!RI) IC19.9(!DSR) IC19.10(!DCD) IC19.12(CBUS4) IC19.13(CBUS2) IC19.14(CBUS3) IC19.19(!RESET) IC19.22(CBUS1) IC19.23(CBUS0) IC19.27(OSCI) IC19.28(OSCO) IC20.4(N/C) USB2.P$4 USB2.SHIELD_2 USB2.SHIELD_3

### Notes on the sheet
- 3.3V@250mA
  Ireq ~100mA
- --------------------------------------------- USB UART ---------------------------------------------
- Case A
- Licensed under the TAPR Open 
  Hardware License (www.tapr.org/OHL)
  Copyright 2021 - Artur Silva and Filipe Carvalho

## Sheet 7 of 8
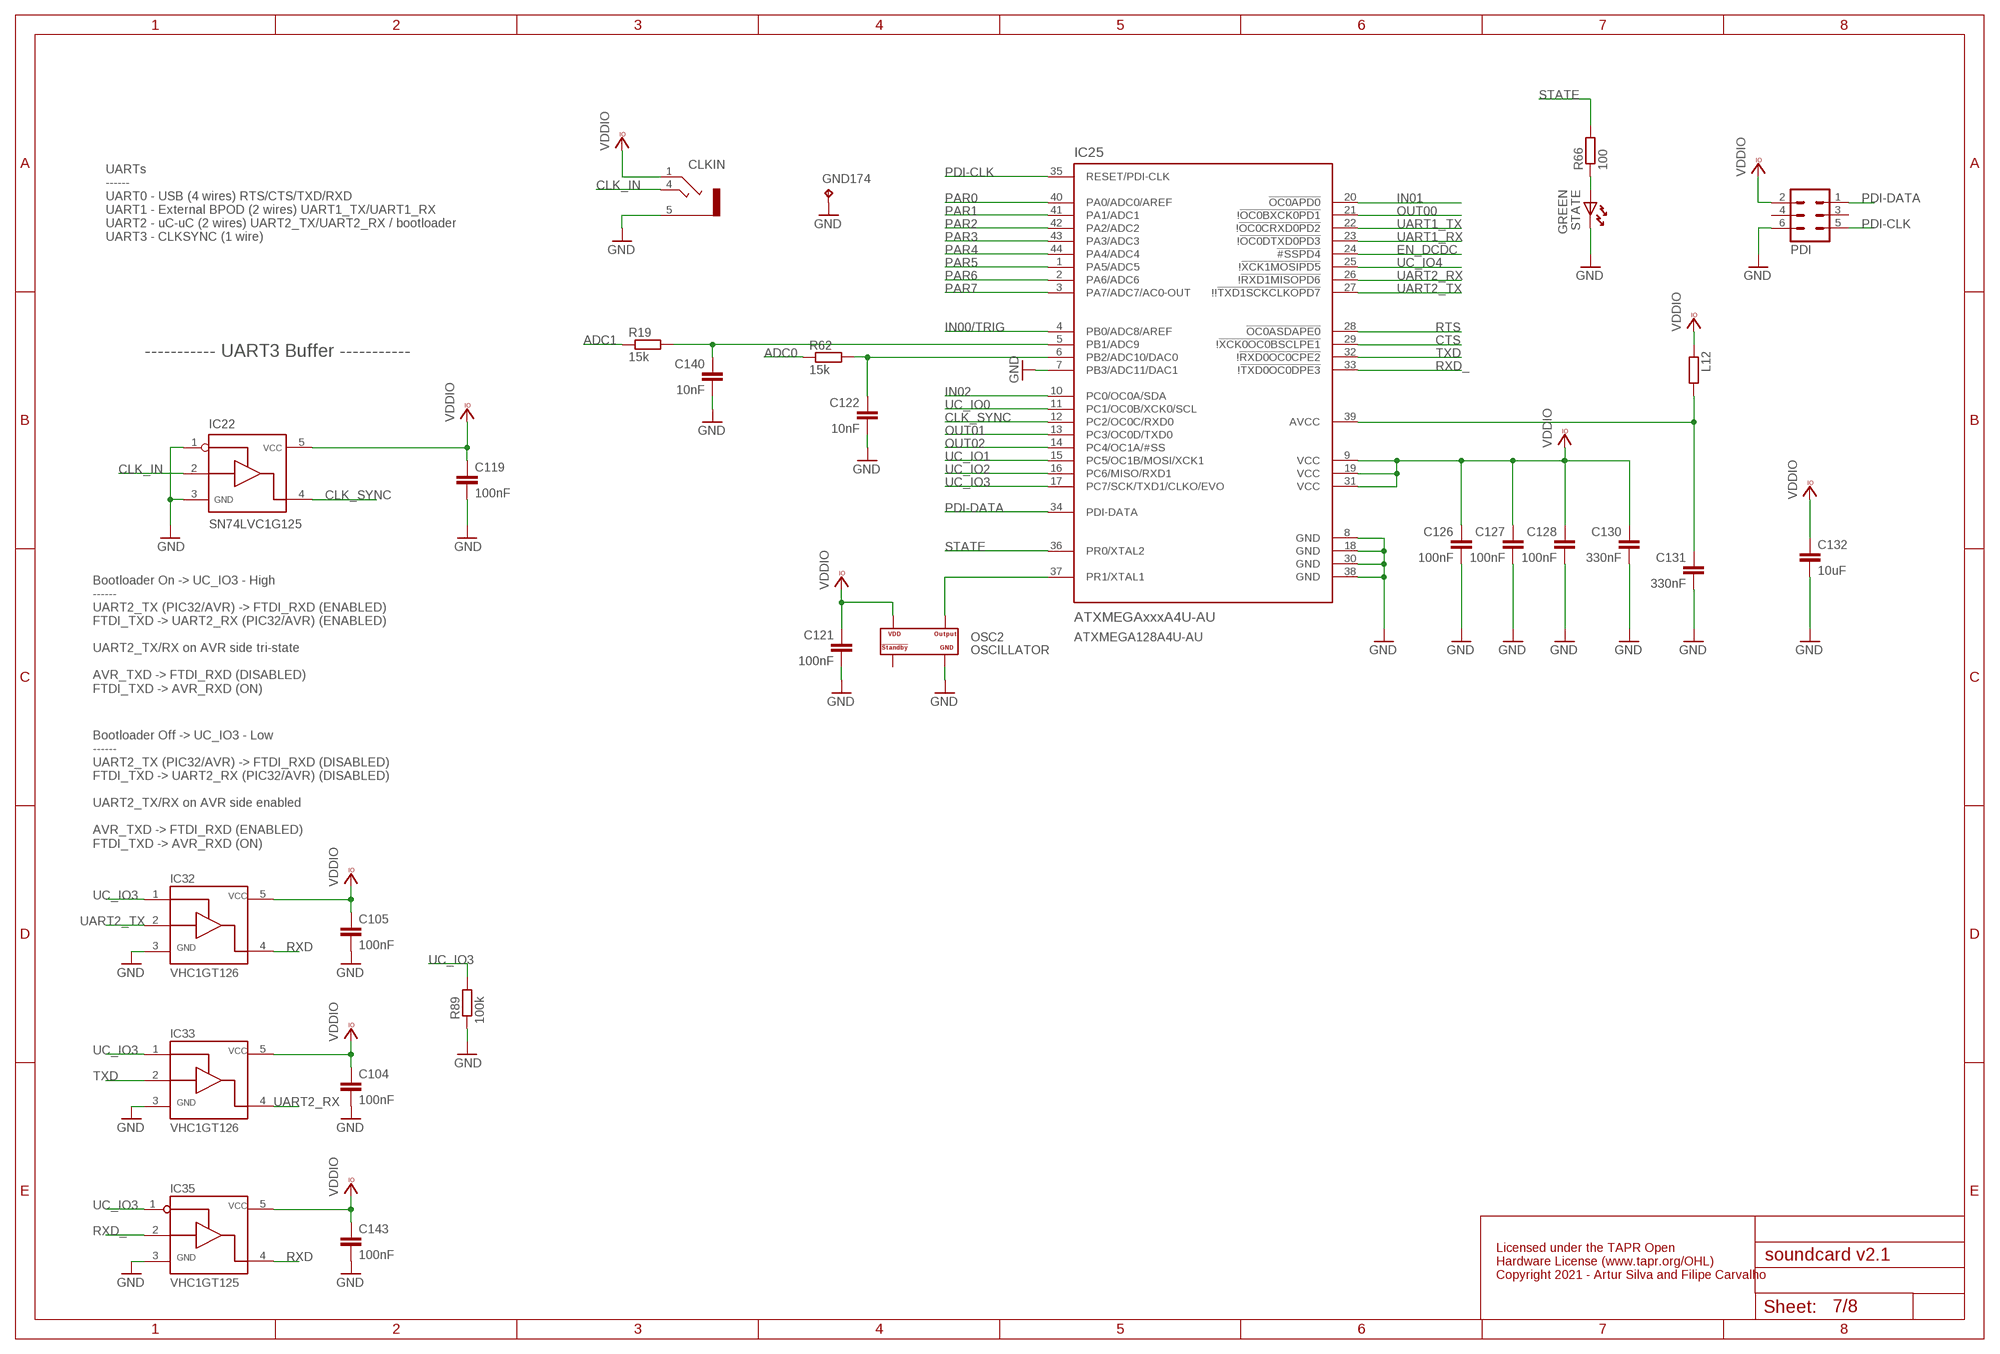
[diagram p6: schematic, sheet 7]

### Parts
C104  100nF  C-EUC0402  [C0402]
C105  100nF  C-EUC0402  [C0402]
C119  100nF  C-EUC0402  [C0402]
C121  100nF  C-EUC0402  [C0402]
C122  10nF  C-EUC0402  [C0402]
C126  100nF  C-EUC0402  [C0402]
C127  100nF  C-EUC0402  [C0402]
C128  100nF  C-EUC0402  [C0402]
C130  330nF  C-EUC0402  [C0402]
C131  330nF  C-EUC0402  [C0402]
C132  10uF  C-EUC0603  [C0603]
C140  10nF  C-EUC0402  [C0402]
C143  100nF  C-EUC0402  [C0402]
CLKIN  STEREO_JACK  [35RASMT2BHNTRX]
GND174  TP  [TP_1]
IC22  SN74LVC1G125  [SOT23-5]
IC25  ATXMEGAxxxA4U-AU  AT-XMEGA-XXA4-AU  [QFP80P1200X1200X120-44N]
IC32  VHC1GT126  [SC-70-5]
IC33  VHC1GT126  [SC-70-5]
IC35  VHC1GT125  [SC-70-5]
L12  ???  R-EU_R0805  [R0805]
OSC2  OSCILLATOR  [OSCILLATOR_3.2X2.5]
PDI  MA03-2  [MA03-2]
R19  15k  R-EU_R0402  [R0402]
R62  15k  R-EU_R0402  [R0402]
R66  100  R-EU_R0402  [R0402]
R89  100k  R-EU_R0402  [R0402]
STATE  GREEN  LEDHAND  [LED_HAND]

### Nets
A+3V3: C131.1 IC25.39(AVCC) L12.2
ADC0: R62.1 ; also sheet 5,8
ADC1: R19.1 ; also sheet 5,8
CLK_IN: CLKIN.4 IC22.2
CLK_SYNC: IC22.4 IC25.12(PC2/OC0C/RXD0)
CTS: IC25.29(!!XCK0OC0BSCLPE1) ; also sheet 6
EN_DCDC: IC25.24(!#SSPD4) ; also sheet 1
GND: C104.2 C105.2 C119.2 C121.2 C122.2 C126.2 C127.2 C128.2 C130.2 C131.2 C132.2 C140.2 C143.2 CLKIN.5 GND174.TP IC22.1 IC22.3 IC25.7(PB3/ADC11/DAC1) IC25.8(GND) IC25.18(GND) IC25.30(GND) IC25.38(GND) IC32.3(GND) IC33.3(GND) IC35.3(GND) OSC2.P$2(GND) PDI.6 R89.2 STATE.K ; also sheet 1,2,3,4,5,6,8
IN00/TRIG: IC25.4(PB0/ADC8/AREF) ; also sheet 5,8
IN01: IC25.20(!OC0APD0) ; also sheet 8
IN02: IC25.10(PC0/OC0A/SDA) ; also sheet 8
N$10: C140.1 IC25.5(PB1/ADC9) R19.2
N$16: C122.1 IC25.6(PB2/ADC10/DAC0) R62.2
N$23: R66.1 STATE.A
OSC1: IC25.37(PR1/XTAL1) OSC2.P$3(OUTPUT)
OUT00: IC25.21(!!OC0BXCK0PD1) ; also sheet 5,8
OUT01: IC25.13(PC3/OC0D/TXD0) ; also sheet 8
OUT02: IC25.14(PC4/OC1A/#SS) ; also sheet 8
PAR0: IC25.40(PA0/ADC0/AREF) ; also sheet 5
PAR1: IC25.41(PA1/ADC1) ; also sheet 5
PAR2: IC25.42(PA2/ADC2) ; also sheet 5
PAR3: IC25.43(PA3/ADC3) ; also sheet 5
PAR4: IC25.44(PA4/ADC4) ; also sheet 5
PAR5: IC25.1(PA5/ADC5) ; also sheet 5
PAR6: IC25.2(PA6/ADC6) ; also sheet 5
PAR7: IC25.3(PA7/ADC7/AC0-OUT) ; also sheet 5
PDI-CLK: IC25.35(RESET/PDI-CLK) PDI.5
PDI-DATA: IC25.34(PDI-DATA) PDI.1
RTS: IC25.28(!OC0ASDAPE0) ; also sheet 6
RXD: IC32.4(OUT) IC35.4(OUT) ; also sheet 6
RXD_: IC25.33(!!TXD0OC0DPE3) IC35.2(IN)
STATE: IC25.36(PR0/XTAL2) R66.2
TXD: IC25.32(!!RXD0OC0CPE2) IC33.2(IN) ; also sheet 6
UART1_RX: IC25.23(!!OC0DTXD0PD3)
UART1_TX: IC25.22(!!OC0CRXD0PD2)
UART2_RX: IC25.26(!!RXD1MISOPD6) IC33.4(OUT) ; also sheet 5
UART2_TX: IC25.27(!!!TXD1SCKCLKOPD7) IC32.2(IN) ; also sheet 5
UC_IO0: IC25.11(PC1/OC0B/XCK0/SCL) ; also sheet 5
UC_IO1: IC25.15(PC5/OC1B/MOSI/XCK1) ; also sheet 5
UC_IO2: IC25.16(PC6/MISO/RXD1) ; also sheet 5
UC_IO3: IC25.17(PC7/SCK/TXD1/CLKO/EVO) IC32.1(OE) IC33.1(OE) IC35.1(!OE) R89.1 ; also sheet 5
UC_IO4: IC25.25(!!XCK1MOSIPD5) ; also sheet 5
VCCIO: C104.1 C105.1 C119.1 C121.1 C126.1 C127.1 C128.1 C130.1 C132.1 C143.1 CLKIN.1 IC22.5 IC25.9(VCC) IC25.19(VCC) IC25.31(VCC) IC32.5(VCC) IC33.5(VCC) IC35.5(VCC) L12.1 OSC2.P$4(VDD) PDI.2 ; supply symbol labelled VDDIO ; also sheet 1,6,8
Unconnected: OSC2.P$1(STANDBY#) PDI.3 PDI.4

### Notes on the sheet
- UARTs
  ------
  UART0 - USB (4 wires) RTS/CTS/TXD/RXD
  UART1 - External BPOD (2 wires) UART1_TX/UART1_RX
  UART2 - uC-uC (2 wires) UART2_TX/UART2_RX / bootloader
  UART3 - CLKSYNC (1 wire)
- ----------- UART3 Buffer -----------
- ATXMEGA128A4U-AU
- Bootloader On -> UC_IO3 - High 
  ------
  UART2_TX (PIC32/AVR) -> FTDI_RXD (ENABLED)
  FTDI_TXD -> UART2_RX (PIC32/AVR) (ENABLED)
  
  UART2_TX/RX on AVR side tri-state
  
  AVR_TXD -> FTDI_RXD (DISABLED)
  FTDI_TXD -> AVR_RXD (ON)
- Bootloader Off -> UC_IO3 - Low 
  ------
  UART2_TX (PIC32/AVR) -> FTDI_RXD (DISABLED)
  FTDI_TXD -> UART2_RX (PIC32/AVR) (DISABLED)
  
  UART2_TX/RX on AVR side enabled
  
  AVR_TXD -> FTDI_RXD (ENABLED)
  FTDI_TXD -> AVR_RXD (ON)
- Licensed under the TAPR Open 
  Hardware License (www.tapr.org/OHL)
  Copyright 2021 - Artur Silva and Filipe Carvalho

## Sheet 8 of 8
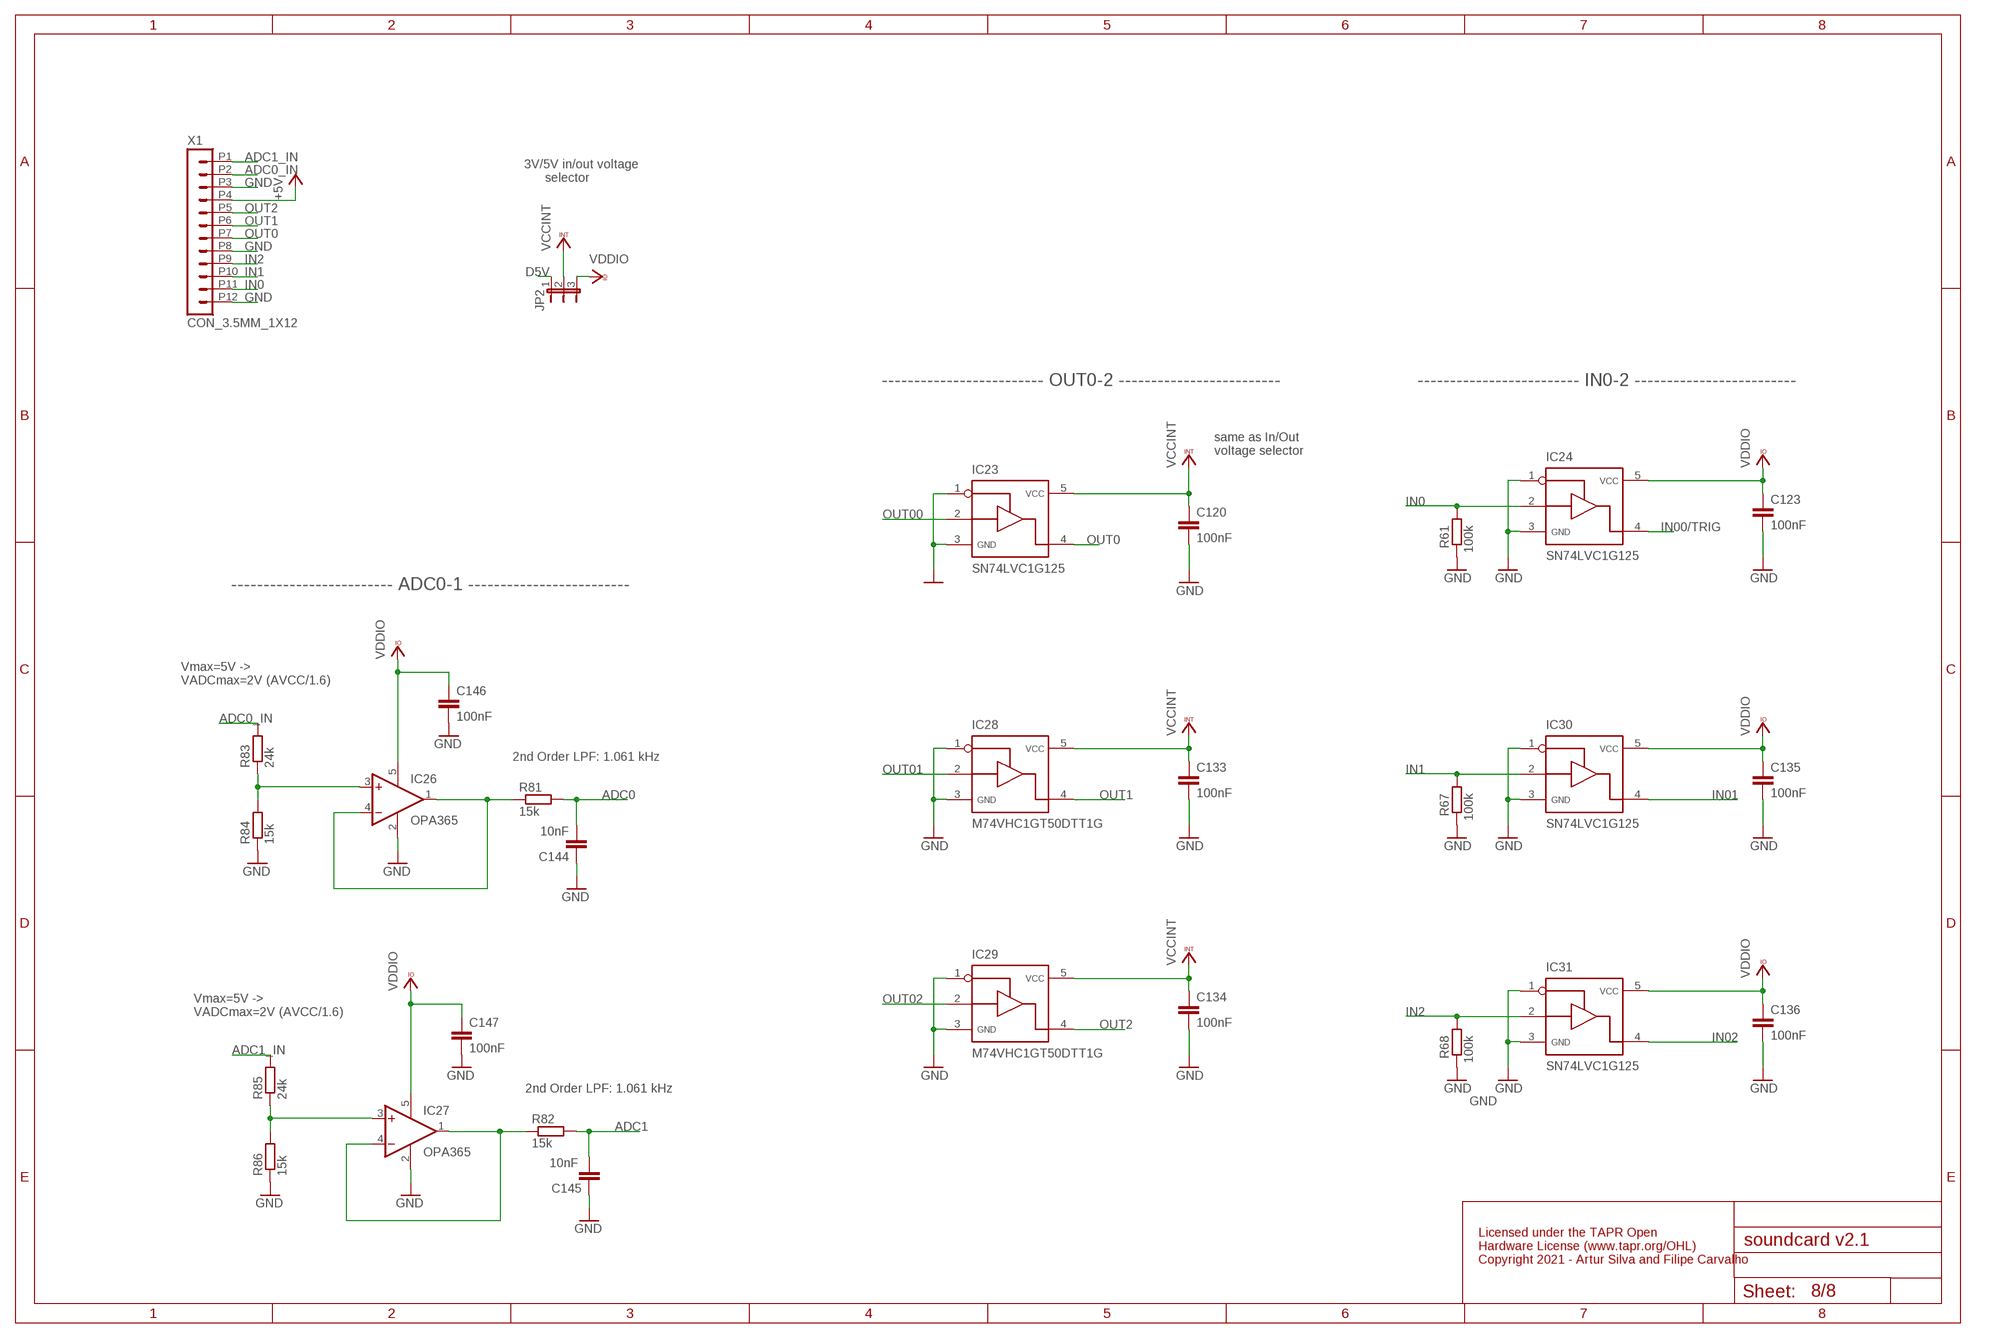
[diagram p7: schematic, sheet 8]

### Parts
C120  100nF  C-EUC0402  [C0402]
C123  100nF  C-EUC0402  [C0402]
C133  100nF  C-EUC0402  [C0402]
C134  100nF  C-EUC0402  [C0402]
C135  100nF  C-EUC0402  [C0402]
C136  100nF  C-EUC0402  [C0402]
C144  10nF  C-EUC0402  [C0402]
C145  10nF  C-EUC0402  [C0402]
C146  100nF  C-EUC0402  [C0402]
C147  100nF  C-EUC0402  [C0402]
IC23  SN74LVC1G125  [SOT23-5]
IC24  SN74LVC1G125  [SOT23-5]
IC26  OPA365  [SOT23-5]
IC27  OPA365  [SOT23-5]
IC28  M74VHC1GT50DTT1G  SN74LVC1G125  [SOT23-5]
IC29  M74VHC1GT50DTT1G  SN74LVC1G125  [SOT23-5]
IC30  SN74LVC1G125  [SOT23-5]
IC31  SN74LVC1G125  [SOT23-5]
JP2  JP2E  [JP2]
R61  100k  R-EU_R0402  [R0402]
R67  100k  R-EU_R0402  [R0402]
R68  100k  R-EU_R0402  [R0402]
R81  15k  R-EU_R0402  [R0402]
R82  15k  R-EU_R0402  [R0402]
R83  24k  R-EU_R0402  [R0402]
R84  15k  R-EU_R0402  [R0402]
R85  24k  R-EU_R0402  [R0402]
R86  15k  R-EU_R0402  [R0402]
X1  CON_3.5MM_1X12  [CON_3.5MM_1X12]

### Nets
+5V: X1.P4
ADC0: C144.2 R81.2 ; also sheet 5,7
ADC0_IN: R83.2 X1.P2
ADC1: C145.2 R82.2 ; also sheet 5,7
ADC1_IN: R85.2 X1.P1
D5V: JP2.1 ; also sheet 5,6
GND: C120.2 C123.2 C133.2 C134.2 C135.2 C136.2 C144.1 C145.1 C146.2 C147.2 IC23.1 IC23.3 IC24.1 IC24.3 IC26.2(V-) IC27.2(V-) IC28.1 IC28.3 IC29.1 IC29.3 IC30.1 IC30.3 IC31.1 IC31.3 R61.2 R67.2 R68.2 R84.1 R86.1 X1.P3 X1.P8 X1.P12 ; also sheet 1,2,3,4,5,6,7
IN0: IC24.2 R61.1 X1.P11
IN00/TRIG: IC24.4 ; also sheet 5,7
IN01: IC30.4 ; also sheet 7
IN1: IC30.2 R67.1 X1.P10
IN02: IC31.4 ; also sheet 7
IN2: IC31.2 R68.1 X1.P9
N$1: IC26.1(OUT) IC26.4(-IN) R81.1
N$8: IC27.1(OUT) IC27.4(-IN) R82.1
N$44: IC26.3(+IN) R83.1 R84.2
N$57: IC27.3(+IN) R85.1 R86.2
OUT00: IC23.2 ; also sheet 5,7
OUT0: IC23.4 X1.P7
OUT01: IC28.2 ; also sheet 7
OUT1: IC28.4 X1.P6
OUT02: IC29.2 ; also sheet 7
OUT2: IC29.4 X1.P5
VCCINT: C120.1 C133.1 C134.1 IC23.5 IC28.5 IC29.5 JP2.2
VCCIO: C123.1 C135.1 C136.1 C146.1 C147.1 IC24.5 IC26.5(V+) IC27.5(V+) IC30.5 IC31.5 JP2.3 ; supply symbol labelled VDDIO ; also sheet 1,6,7

### Notes on the sheet
- 3V/5V in/out voltage
        selector
- ------------------------- OUT0-2 ------------------------- | ------------------------- IN0-2 -------------------------
- same as In/Out 
  voltage selector
- ------------------------- ADC0-1 -------------------------
- Vmax=5V -> 
  VADCmax=2V (AVCC/1.6)
- 2nd Order LPF: 1.061 kHz
- Vmax=5V -> 
  VADCmax=2V (AVCC/1.6)
- 2nd Order LPF: 1.061 kHz
- Licensed under the TAPR Open 
  Hardware License (www.tapr.org/OHL)
  Copyright 2021 - Artur Silva and Filipe Carvalho

## Library data of the parts
C1 C3-C27 C29-C32 C34 C36-C42 C45 C46 C49 C50 C52 C53 C55 C56 C58-C66 C69 C70 C73 C74 C76 C77 C79 C80 C82-C102 C104-C108 C111 C113-C121 C123 C126-C128 C130-C139 C143 C148 C149 CUSB1 CUSB2 = rcl:C-EU: CAPACITOR, European symbol; SPICEPREFIX: C
C2 = rcl:CPOL-EU: POLARIZED CAPACITOR, European symbol; SPICEPREFIX: C
C28 C33 C35 C112 = rcl:CPOL-EU: POLARIZED CAPACITOR, European symbol
C43 C44 C47 C48 C51 C54 C57 C67 C68 C71 C72 C75 C78 C81 = adafruit:C-US: CAPACITOR, American symbol
C122 C140-C142 C144-C147 = rcl:C-EU: CAPACITOR, European symbol
CLKIN = CNP-connectors:STEREO_JACK
D1 D2 = CNP-miscellaneous:DIODE
GND GND26 GND174 GND176 TP0 TP1 = CNP-miscellaneous:TP
IC1 = CNP-ics 2:ADP7118
IC2 = CNP-ics 1:ADP5070
IC3 = CNP-ics 2:ADP7182
IC4 IC5 IC18 IC20 = CNP:TLV700XX
IC6 = CNP-ics 1:AD1955
IC7-IC12 = CNP-ics 1:AD797
IC13 = CNP-ics 1:S34ML
IC14 = CNP-ics 1:TPS73801
IC15 IC17 = CNP 2:USBLC6-2
IC16 = CNP-ics 1:PIC32MZ2048EFM100
IC19 = ftdichip:FT232R: Source: http://www.ftdichip.com/Documents/DataSheets/DS_FT232R_v104.pdf; MPN: FT232RL; OC_FARNELL: 1146032; OC_NEWARK: 91K9918
IC21 = CNP-ics 2:SI8645
IC22-IC24 IC28-IC31 = My_library 0v2:SN74LVC1G125
IC25 = xmega-a4:AT-XMEGA-XXA4-AU: ATxMega a4 Serie
IC26 IC27 = CNP-ics 2:OPA365
IC32 IC33 = CNP-ics 1:VHC1GT126
IC35 = CNP-ics 1:VHC1GT125
J3 J4 = CNP-connectors:RCA
JACK = CNP-miscellaneous:DC_JACK
JP1 = SparkFun-Connectors:M06: Header 6 Standard 6-pin 0.1" header. Use with straight break away headers (SKU : PRT-00116), right angle break away headers (PRT-00553), swiss pins (PRT-00743), machine pins (PRT-00117), and female headers (PRT-00115). Molex polarized connector foot print use with SKU : PRT-08094 with associated crimp pins and housings. NOTES ON THE VARIANTS LOCK and LOCK_LONGPADS... This footprint was designed to help hold the alignment of a through-hole component (i.e. 6-pin header) while soldering it into place. You may notice that each hole has been shifted either up or down by 0.005 of an inch from it's more standard position (which is a perfectly straight line). This slight alteration caused the pins (the squares in the middle) to touch the edges of the holes. Because they are alternating, it causes a "brace" to hold the component in place. 0.005 has proven to be the perfect amount of "off-center" position when using our standard breakaway headers. Although looks a little odd when you look at the bare footprint, once you have a header in there, the alteration is very hard to notice. Also,if you push a header all the way into place, it is covered up entirely on the bottom side. This idea of altering the position of holes to aid alignment will be further integrated into the Sparkfun Library for other footprints. It can help hold any component with 3 or more connection pins.
JP2 = jumper:JP2E: JUMPER
L1-L4 = CNP-miscellaneous:IND
L5-L10 L12 L13 R1-R18 R20-R57 R61 R66-R68 R74-R80 R87-R89 RUSB1 RUSB2 = rcl:R-EU_: RESISTOR, European symbol; SPICEPREFIX: R
LED1-LED3 STATE = CNP-miscellaneous:LED
OSC1-OSC3 = CNP-miscellaneous:OSCILLATOR
PDI = con-lstb:MA03-2: PIN HEADER; OC_FARNELL: unknown; OC_NEWARK: unknown
R19 R60 R62 R71 R81-R86 = rcl:R-EU_: RESISTOR, European symbol
SW1 = CNP-miscellaneous:SW1
USB1 = CNP-connectors:USB_MICRO_B
USB2 = CNP-connectors:USB_MINI_B
X1 = CNP-connectors:CON_3.5MM_1X12